# Altium project LTO 12S BMS.PrjPcb
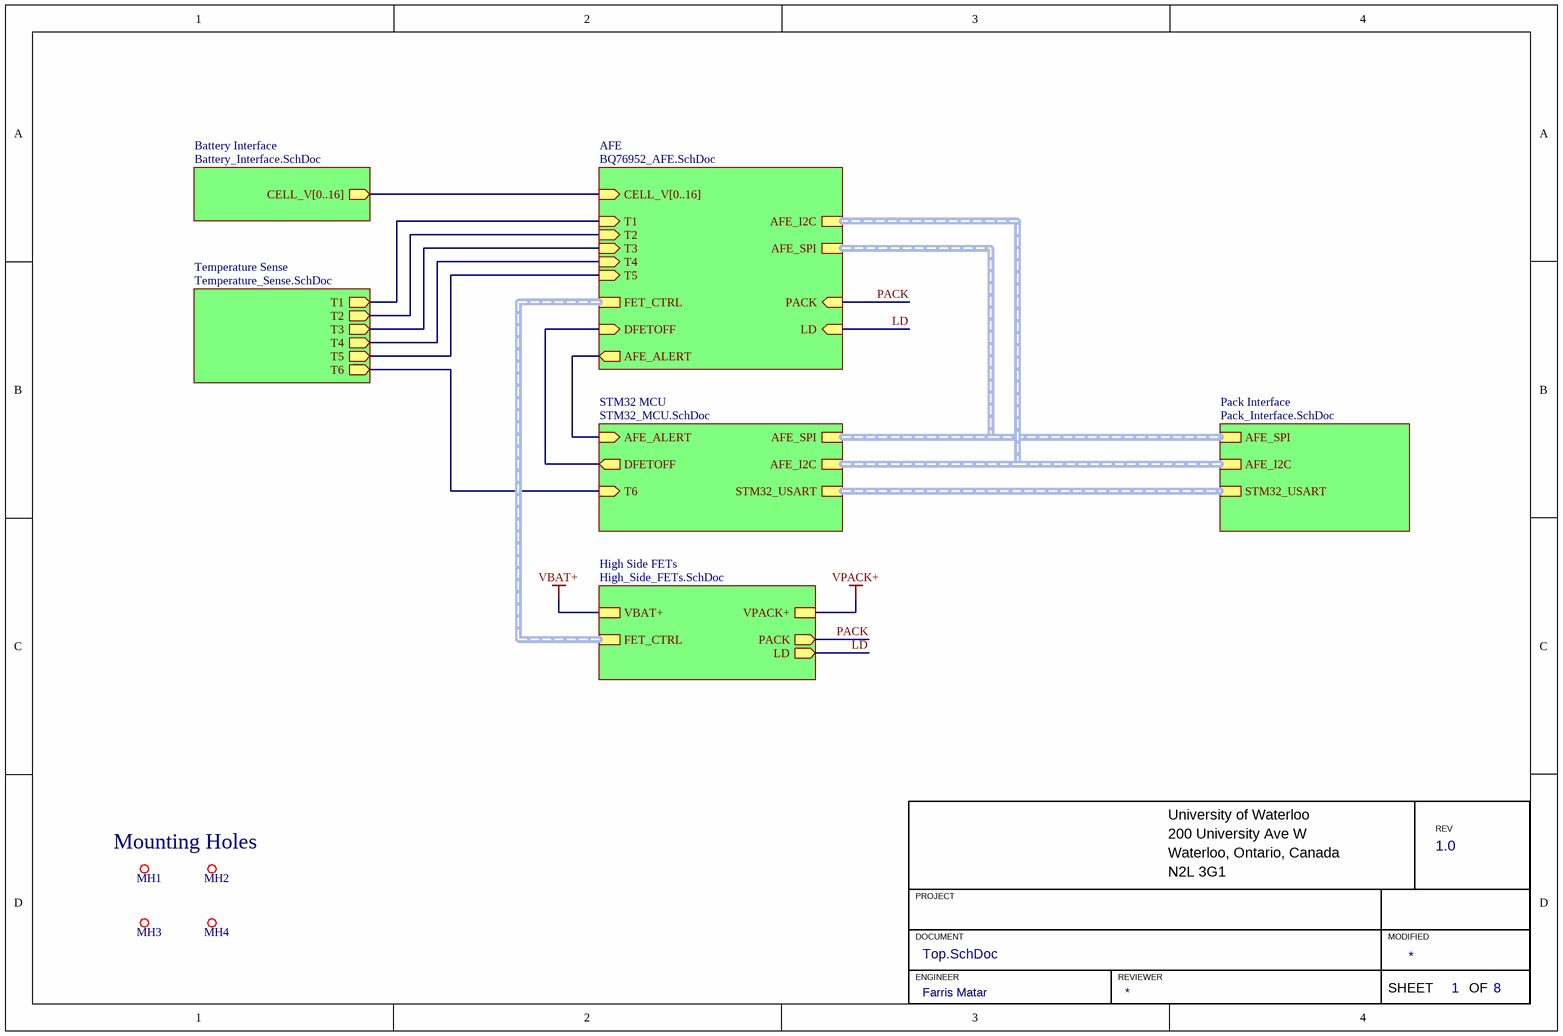
[diagram p0: Top.SchDoc]
Engineer: Farris Matar; Revision: 1.0; Title: LTO 16S BMS
7 sheets, 241 parts. Net scope: hierarchical (ports join the sheet entries above them; power ports are global).
Board file: LTO 12S BMS.PcbDoc
Sheets:
  Top.SchDoc
    Battery Interface = Battery_Interface.SchDoc
    AFE = BQ76952_AFE.SchDoc
      Balancing FETs = Balancing_FETs.SchDoc
    Temperature Sense = Temperature_Sense.SchDoc
    Pack Interface = Pack_Interface.SchDoc
    High Side FETs = High_Side_FETs.SchDoc

## Sheet Top.SchDoc: LTO 16S BMS
size A4; Engineer: Farris Matar; Organization: TESLA Motors, INC; Address1: 3500 Deer Creek Road; Address2: Palo Alto, CA; Address4: U.S.A.; SheetNumber: 1; SheetTotal: 8

### Parts
MH1  MOUNTING_HOLE_M3  [MOUNTING_HOLE_3mm]  (value not drawn)  (no BOM)
MH2  MOUNTING_HOLE_M3  [MOUNTING_HOLE_3mm]  (value not drawn)  (no BOM)
MH3  MOUNTING_HOLE_M3  [MOUNTING_HOLE_3mm]  (value not drawn)  (no BOM)
MH4  MOUNTING_HOLE_M3  [MOUNTING_HOLE_3mm]  (value not drawn)  (no BOM)

### Sub-sheets
AFE = BQ76952_AFE.SchDoc: CELL_V[0..16] (in), AFE_SPI (harness SPI), AFE_ALERT (out), T1 (in), T2 (in), T3 (in), DFETOFF (in), FET_CTRL (harness FET_CTRL), PACK (in), LD (in), AFE_I2C (harness I2C), T4 (in), T5 (in)
Battery Interface = Battery_Interface.SchDoc: CELL_V[0..16] (out)
High Side FETs = High_Side_FETs.SchDoc: LD (out), PACK (out), VPACK+, FET_CTRL (harness FET_CTRL), VBAT+
Pack Interface = Pack_Interface.SchDoc: STM32_USART (harness USART), AFE_SPI (harness SPI), AFE_I2C (harness I2C)
STM32 MCU = STM32_MCU.SchDoc (file not in this document): AFE_SPI (harness SPI), STM32_USART (harness USART), AFE_ALERT (in), DFETOFF (out), T6 (in), AFE_I2C (harness I2C)
Temperature Sense = Temperature_Sense.SchDoc: T1 (out), T2 (out), T3 (out), T6 (out), T4 (out), T5 (out)

### Nets
LD: sheet AFE/LD, sheet High Side FETs/LD
PACK: sheet AFE/PACK, sheet High Side FETs/PACK
T1: sheet AFE/T1, sheet Temperature Sense/T1
T2: sheet AFE/T2, sheet Temperature Sense/T2
T3: sheet AFE/T3, sheet Temperature Sense/T3
NetJ6#1_1: sheet AFE/T4, sheet Temperature Sense/T4
NetR59_1: sheet AFE/AFE_ALERT, sheet STM32 MCU/AFE_ALERT
NetTP43_1: sheet AFE/DFETOFF, sheet STM32 MCU/DFETOFF
NetU1_32: sheet AFE/T5, sheet Temperature Sense/T5
(unnamed): sheet Temperature Sense/T6, sheet STM32 MCU/T6

### Buses and harness runs
bus sheet AFE/CELL_V[0..16] = sheet Battery Interface/CELL_V[0..16]
harness sheet AFE/AFE_I2C = sheet Pack Interface/AFE_I2C = sheet STM32 MCU/AFE_I2C
harness sheet AFE/AFE_SPI = sheet Pack Interface/AFE_SPI = sheet STM32 MCU/AFE_SPI
harness sheet AFE/FET_CTRL = sheet High Side FETs/FET_CTRL
harness sheet Pack Interface/STM32_USART = sheet STM32 MCU/STM32_USART

### Notes on the sheet
- Mounting Holes
- University of Waterloo
- 200 University Ave W
- REV
- PROJECT
- Waterloo, Ontario, Canada
- N2L 3G1
- DOCUMENT
- ENGINEER
- REVIEWER
- MODIFIED
- SHEET
- OF

## Sheet Battery_Interface.SchDoc: LTO 16S BMS
size A4; Engineer: Farris Matar; Organization: TESLA Motors, INC; Address1: 3500 Deer Creek Road; Address2: Palo Alto, CA; Address4: U.S.A.; SheetNumber: 2; SheetTotal: 7
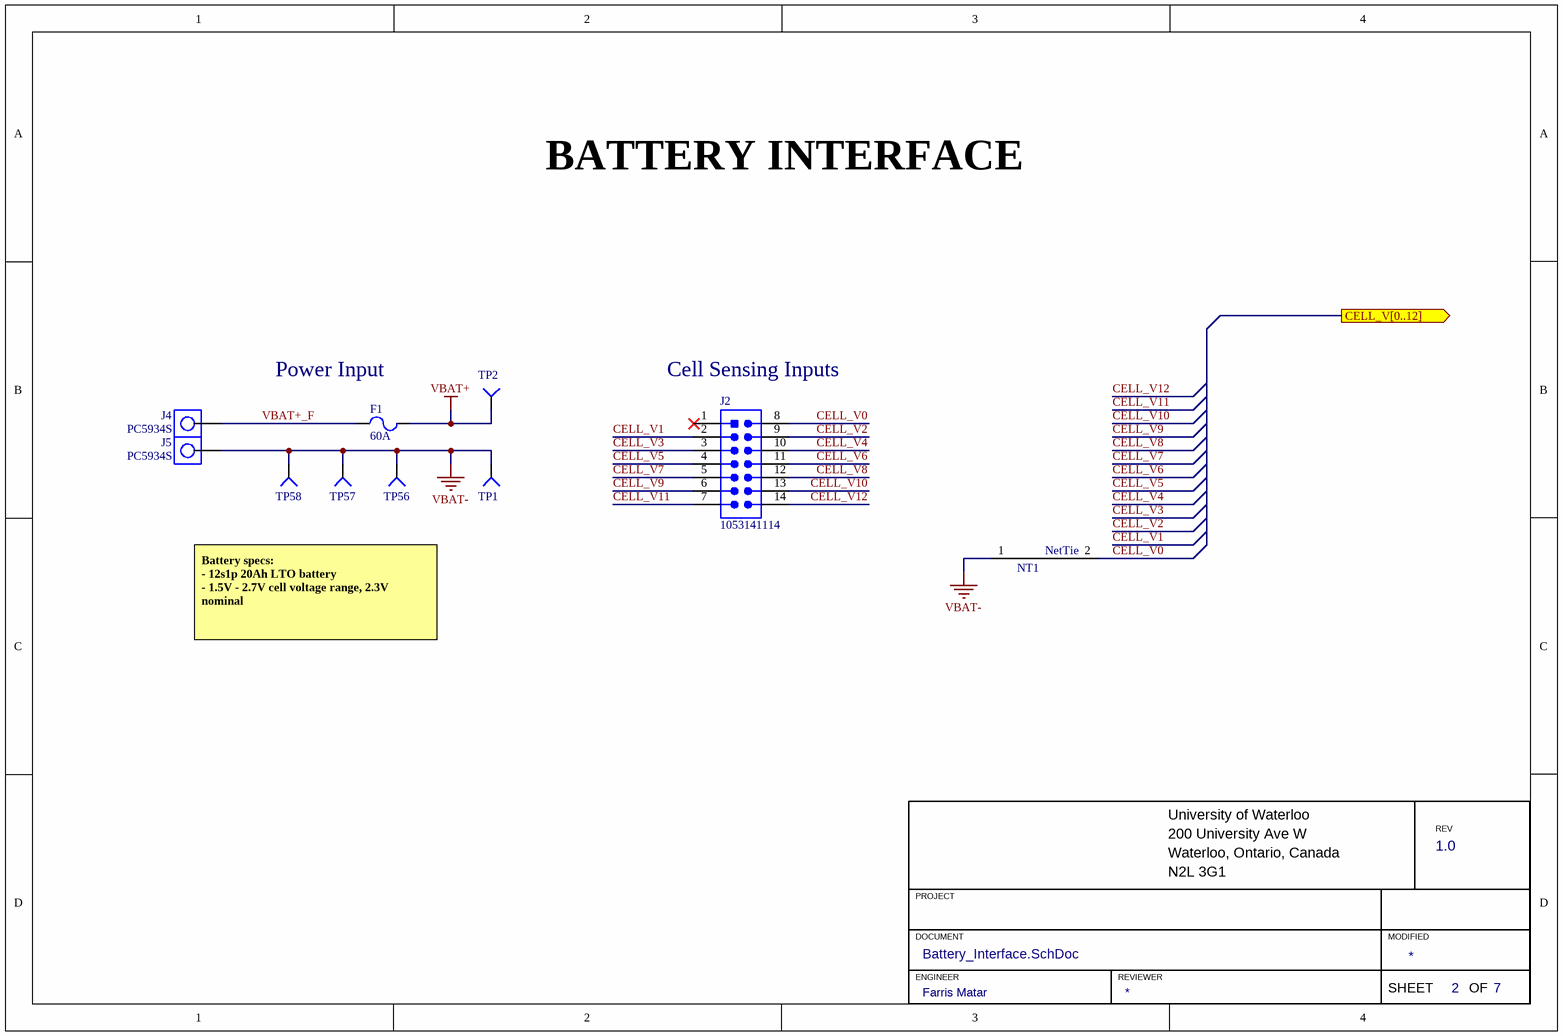
[diagram p1: Battery_Interface.SchDoc]

### Parts
(Parts that share a designator on the sheet are numbered #1, #2 ... from top to bottom, then left to right.)
F1  Current Rating: 60A  [FUSE_456SDE_LITTLEFUSE]  (hidden comment: FUSE_60A_LITTLEFUSE)
J2  1053141114  [MOLEX-NANOFIT 7x2 THRA]
J4#1  Manufacturer Part Number 1: PC5934S  [APP_PC5934S]  (hidden comment: CON_1POS_APP75)
J5#1  Manufacturer Part Number 1: PC5934S  [APP_PC5934S]  (hidden comment: CON_1POS_APP75)
NT1  NetTie  [NET_TIE]  (value not drawn)
TP1  TESTPOINT_SMD_LOOP  [S1751-46R]  (value not drawn)
TP2  TESTPOINT_SMD_LOOP  [S1751-46R]  (value not drawn)
TP56  TESTPOINT_SMD_LOOP  [S1751-46R]  (value not drawn)
TP57  TESTPOINT_SMD_LOOP  [S1751-46R]  (value not drawn)
TP58  TESTPOINT_SMD_LOOP  [S1751-46R]  (value not drawn)

### Ports
CELL_V[0..12] (out)

### Nets
VBAT+: F1.2 TP2.1(=value)
VBAT-: J5#1.1 NT1.1 TP1.1(=value) TP56.1(=value) TP57.1(=value) TP58.1(=value)
CELL_V0: J2.8 NT1.2
CELL_V1: J2.2
CELL_V2: J2.9
CELL_V3: J2.3
CELL_V4: J2.10
CELL_V5: J2.4
CELL_V6: J2.11
CELL_V7: J2.5
CELL_V8: J2.12
CELL_V9: J2.6
CELL_V10: J2.13
CELL_V11: J2.7
CELL_V12: J2.14
VBAT+_F: F1.1 J4#1.1

Not connected (* = marked no-connect by the designer): J2 1*

### Notes on the sheet
- BATTERY INTERFACE
- (near F1) Power Input
- (near J2) Cell Sensing Inputs
- Battery specs:
  - 12s1p 20Ah LTO battery
  - 1.5V - 2.7V cell voltage range, 2.3V nominal
- University of Waterloo
- 200 University Ave W
- REV
- PROJECT
- Waterloo, Ontario, Canada
- N2L 3G1
- DOCUMENT
- ENGINEER
- REVIEWER
- MODIFIED
- SHEET
- OF

### Library data of the parts
F1 = FUSE_60A_LITTLEFUSE: FUSE BRD MT 60A 250VAC 80VDC SMD; Manufacturer 1: Littelfuse Inc.; Manufacturer Part Number 1: 0456060.DRSDE; Mounting Type: SMD; Verified: No; Supplier 1: Digi-Key; Supplier Part Number 1: 18-0456060.DRSDECT-ND
J2 = CON_MOLEX-NANOFIT_7x2_THRA: CONN HEADER R/A 14POS 2.5MM; Manufacturer 1: Molex; Voltage Rating: 250V; Current Rating: 7.5A; Pitch: 2.5mm; Supplier 1: Digi-Key; Supplier Part Number 1: WM16912-ND; Manufacturer Part Number 1: 1053141114
J4#1 J5#1 = CON_1POS_APP75: TERM BLADE NON-GEND SILVER; Manufacturer 1: Anderson Power Products, Inc.; Voltage Rating: 600V; Current Rating: 55A; Supplier 1: Digi-Key; Supplier Part Number 1: 2243-PC5934S-ND
TP1 TP2 TP56-TP58 = TESTPOINT_SMD_LOOP: TESTPOINT SMD LOOP; Manufacturer 1: Harwin; Supplier 1: Digi-Key; Manufacturer Part Number 1: S1751-46R; Mounting Type: SMD; Package/Footprint: SMD; Supplier Part Number 1: 952-1478-1-ND

## Sheet BQ76952_AFE.SchDoc: LTO 16S BMS
size A4; Engineer: Farris Matar; Organization: TESLA Motors, INC; Address1: 3500 Deer Creek Road; Address2: Palo Alto, CA; Address4: U.S.A.; SheetNumber: 3; SheetTotal: 8
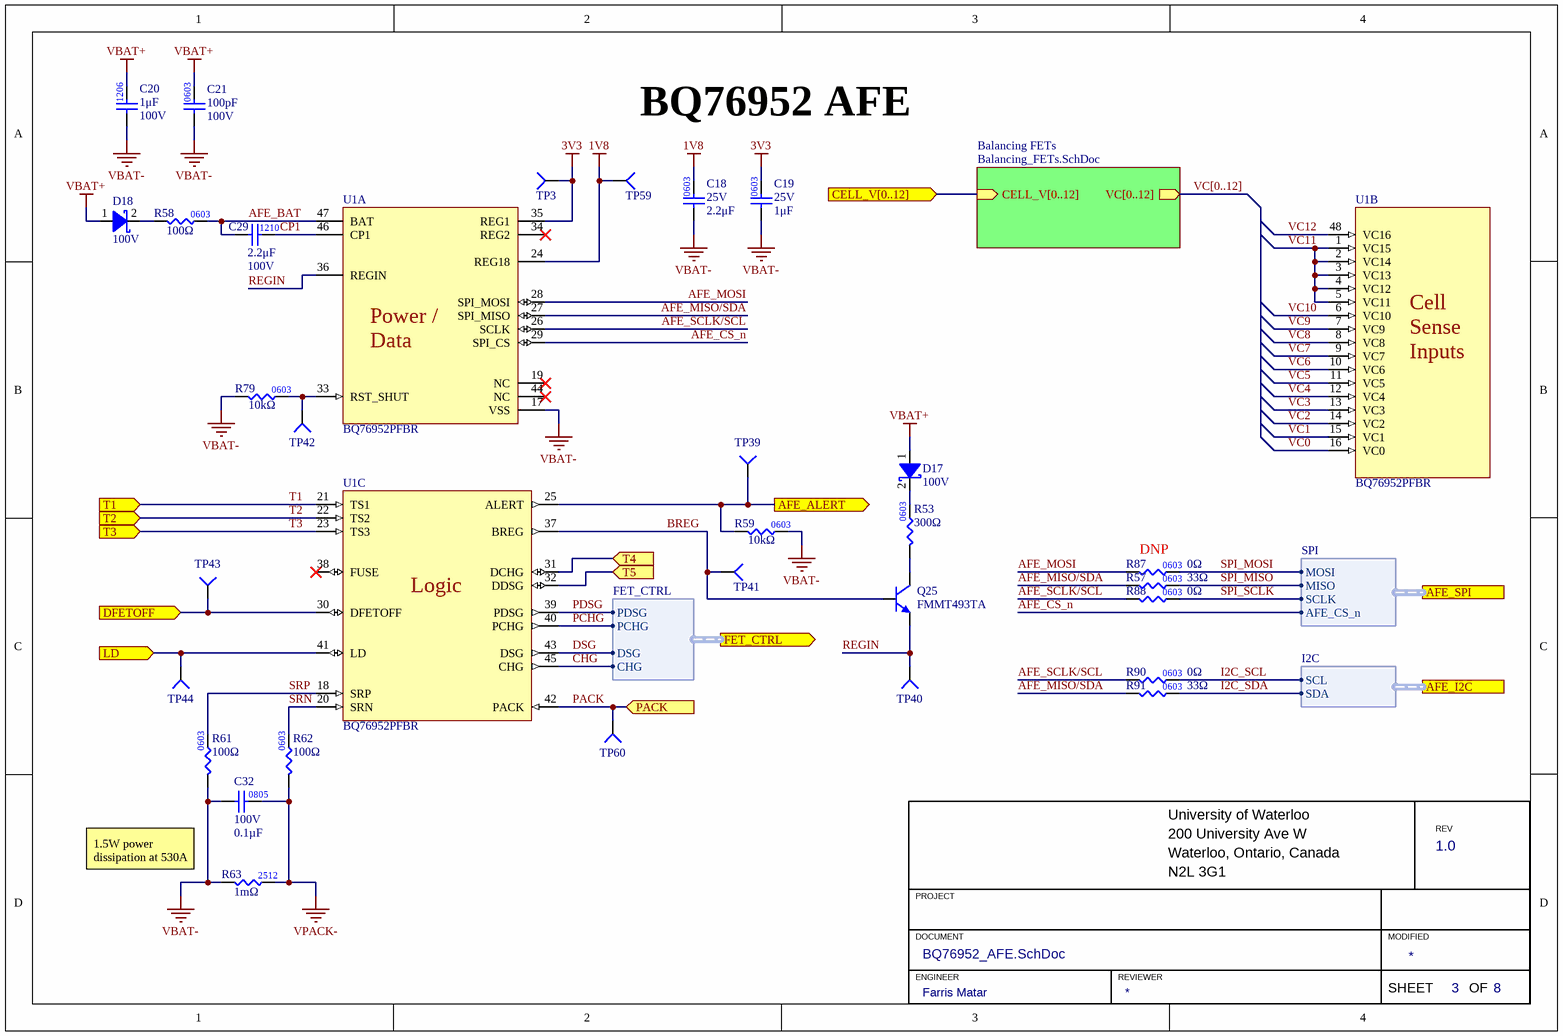
[diagram p2: BQ76952_AFE.SchDoc]

### Parts
C18  value 2.2μF  Voltage Rating: 25V  [CAP0603]  (hidden comment: CAP_2.2uF_25V_0603)
C19  value 1μF  Voltage Rating: 25V  [CAP0603]  (hidden comment: CAP_1uF_25V_0603)
C20  value 1μF  Voltage Rating: 100V  [CAP1206]  (hidden comment: CAP_1uF_100V_1206)
C21  value 100pF  Voltage Rating: 100V  [CAP2012]  (hidden comment: CAP_100pF_100V_0603)
C29  value 2.2μF  Voltage Rating: 100V  [CAP1210]  (hidden comment: CAP_2.2uF_100V_1210)
C32  value 0.1µF  Voltage Rating: 100V  [CAP0805]  (hidden comment: CAP_0.1uF_100V_0805)
D17  Vr (Max): 100V  [SOD-123_FLAT]  (hidden comment: DIO_SCHOTTKY_100V_1A)
D18  Vr (Max): 100V  [SOD-123_FLAT]  (hidden comment: DIO_SCHOTTKY_100V_1A)
Q25  Manufacturer Part Number 1: FMMT493TA  [SOT23-3]  (hidden comment: NPN_100V_1A)
R53  value 300Ω  [RES0603]  (hidden comment: RES_300Ω_0603_1%)
R57  value 33Ω  [RES0603]  (hidden comment: RES_33Ω_0603_1%)
R58  value 100Ω  [RES0603]  (hidden comment: RES_100Ω_0603_1%)
R59  value 10kΩ  [RES0603]  (hidden comment: RES_10kΩ_0603_1%)
R61  value 100Ω  [RES0603]  (hidden comment: RES_100Ω_0603_1%)
R62  value 100Ω  [RES0603]  (hidden comment: RES_100Ω_0603_1%)
R63  value 1mΩ  [RESC6532X75N]  (hidden comment: RES_1mΩ_2512_1%)
R79  value 10kΩ  [RES0603]  (hidden comment: RES_10kΩ_0603_1%)
R87  value 0Ω  [RES0603]  (hidden comment: RES_0Ω_0603)
R88  value 0Ω  [RES0603]  (hidden comment: RES_0Ω_0603)
R90  value 0Ω  [RES0603]  (hidden comment: RES_0Ω_0603)
R91  value 33Ω  [RES0603]  (hidden comment: RES_33Ω_0603_1%)
TP3  TESTPOINT_SMD_LOOP  [S1751-46R]  (value not drawn)
TP39  TESTPOINT_1MM_CIRCLE  [TESTPOINT_CIRCLE_1MM]  (value not drawn)  (no BOM)
TP40  TESTPOINT_1MM_CIRCLE  [TESTPOINT_CIRCLE_1MM]  (value not drawn)  (no BOM)
TP41  TESTPOINT_1MM_CIRCLE  [TESTPOINT_CIRCLE_1MM]  (value not drawn)  (no BOM)
TP42  TESTPOINT_1MM_CIRCLE  [TESTPOINT_CIRCLE_1MM]  (value not drawn)  (no BOM)
TP43  TESTPOINT_1MM_CIRCLE  [TESTPOINT_CIRCLE_1MM]  (value not drawn)  (no BOM)
TP44  TESTPOINT_1MM_CIRCLE  [TESTPOINT_CIRCLE_1MM]  (value not drawn)  (no BOM)
TP59  TESTPOINT_1MM_SQUARE  [TESTPOINT_SQUARE_1MM]  (value not drawn)  (no BOM)
TP60  TESTPOINT_1MM_CIRCLE  [TESTPOINT_CIRCLE_1MM]  (value not drawn)  (no BOM)
U1  BQ76952PFBR  [TI_48-TQFP]  (parts A,B,C of 3)

### Sub-sheets
Balancing FETs = Balancing_FETs.SchDoc: CELL_V[0..12] (in), VC[0..12] (out)

### Ports
AFE_ALERT (out), AFE_I2C (harness I2C), AFE_SPI (harness SPI), CELL_V[0..12] (in), DFETOFF (in), FET_CTRL (out, harness FET_CTRL), LD (in), PACK (in), T1 (in), T2 (in), T3 (in), T4 (in), T5 (in)

### Harnesses
SPI: MOSI, MISO, SCLK, AFE_CS_n
FET_CTRL: PDSG, PCHG, DSG, CHG
I2C: SCL, SDA

### Nets
1V8: C18.2 TP59.1(=value) U1.24(REG18)
3V3: C19.2 TP3.1(=value) U1.35(REG1)
VBAT+: C20.2 C21.2 D17.1(Anode) D18.1(Anode)
VBAT-: C18.1 C19.1 C20.1 C21.1 C32.1 R59.2 R61.1 R63.1 R79.1 U1.17(VSS)
VPACK-: C32.2 R62.1 R63.2
AFE_BAT: C29.1 R58.2 U1.47(BAT)
AFE_CS_n: U1.29(SPI_CS) ; port AFE_SPI.AFE_CS_n
AFE_MISO/SDA: R57.1 R91.1 U1.27(SPI_MISO)
AFE_MOSI: R87.1 U1.28(SPI_MOSI)
AFE_SCLK/SCL: R88.1 R90.1 U1.26(SCLK)
BREG: Q25.1(B) TP41.1(=value) U1.37(BREG)
CHG: U1.45(CHG) ; port FET_CTRL.CHG
CP1: C29.2 U1.46(CP1)
DSG: U1.43(DSG) ; port FET_CTRL.DSG
I2C_SCL: R90.2 ; port AFE_I2C.SCL
I2C_SDA: R91.2 ; port AFE_I2C.SDA
LD: TP44.1(=value) U1.41(LD) ; port LD
PACK: TP60.1(=value) U1.42(PACK) ; port PACK
PCHG: U1.40(PCHG) ; port FET_CTRL.PCHG
PDSG: U1.39(PDSG) ; port FET_CTRL.PDSG
REGIN: Q25.2(E) TP40.1(=value) U1.36(REGIN)
SPI_MISO: R57.2 ; port AFE_SPI.MISO
SPI_MOSI: R87.2 ; port AFE_SPI.MOSI
SPI_SCLK: R88.2 ; port AFE_SPI.SCLK
SRN: R62.2 U1.20(SRN)
SRP: R61.2 U1.18(SRP)
T1: U1.21(TS1) ; port T1
T2: U1.22(TS2) ; port T2
T3: U1.23(TS3) ; port T3
VC0: U1.16(VC0)
VC1: U1.15(VC1)
VC2: U1.14(VC2)
VC3: U1.13(VC3)
VC4: U1.12(VC4)
VC5: U1.11(VC5)
VC6: U1.10(VC6)
VC7: U1.9(VC7)
VC8: U1.8(VC8)
VC9: U1.7(VC9)
VC10: U1.6(VC10)
VC11: U1.1(VC15) U1.2(VC14) U1.3(VC13) U1.4(VC12) U1.5(VC11)
VC12: U1.48(VC16)
NetD17_2: D17.2(Cathode) R53.2
NetD18_2: D18.2(Cathode) R58.1
NetJ6#1_1: U1.31(DCHG) ; port T4
NetQ25_3: Q25.3(C) R53.1
NetR59_1: R59.1 TP39.1(=value) U1.25(ALERT) ; port AFE_ALERT
NetR79_2: R79.2 TP42.1(=value) U1.33(RST_SHUT)
NetTP43_1: TP43.1(=value) U1.30(DFETOFF) ; port DFETOFF
NetU1_32: U1.32(DDSG) ; port T5

Not connected (* = marked no-connect by the designer): U1 19(NC)* 34(REG2)* 38(FUSE)* 44(NC)*

### Buses and harness runs
bus port CELL_V[0..12] = sheet Balancing FETs/CELL_V[0..12]
bus VC[0..12] = sheet Balancing FETs/VC[0..12]

### Notes on the sheet
- BQ76952 AFE
- (near R87) DNP
- University of Waterloo
- 200 University Ave W
- REV
- 1.5W power dissipation at 530A
- PROJECT
- Waterloo, Ontario, Canada
- N2L 3G1
- DOCUMENT
- ENGINEER
- REVIEWER
- MODIFIED
- SHEET
- OF
- (in symbol BQ7695204PFBR, part A) Power / / Data
- (in symbol BQ7695204PFBR, part B) Cell / Sense / Inputs
- (in symbol BQ7695204PFBR, part C) Logic
- (in symbol CAP_2.2uF_25V_0603) 0603
- (in symbol CAP_2.2uF_100V_1210) 1210
- (in symbol RES_100Ω_0603_1%) 0603

### Library data of the parts
C18 = CAP_2.2uF_25V_0603: CAP CER 2.2UF 25V X5R 0603; Manufacturer Part Number 1: C1608X5R1E225K080AB; Manufacturer 1: TDK Corporation; Dielectric: 5; Supplier Part Number 1: 445-5964-1-ND; Supplier 1: Digi-Key
C19 = CAP_1uF_25V_0603: CAP CER 1UF 25V X5R 0603; Manufacturer 1: Samsung; Manufacturer Part Number 1: CL10A105KA8NNNC; Supplier 1: Digi-Key; Mounting Type: SMD; Package: 0603; Supplier Part Number 1: 1276-1102-1-ND; Dielectric: X5R
C20 = CAP_1uF_100V_1206: CAP CER 1UF 100V X7R 1206; Supplier 1: Digi-Key; Mounting Type: SMD; Package: 1206; Supplier Part Number 1: 490-16468-1-ND
C21 = CAP_100pF_100V_0603: CAP CER 100PF 100V X7R 0603; Manufacturer 1: YAGEO; Manufacturer Part Number 1: CC0603KRX7R0BB101; Package/Footprint: 0603; Mounting Type: SMD; Dielectric: X7R; Supplier 1: Digi-Key; Supplier Part Number 1: 311-4048-1-ND
C29 = CAP_2.2uF_100V_1210: CAP CER 2.2UF 100V X7R 1210; Manufacturer 1: Taiyo Yuden; Manufacturer Part Number 1: HMK325B7225KMHP; Dielectric: X7R; Supplier 1: Digi-Key; Supplier Part Number 1: 587-5396-1-ND
C32 = CAP_0.1uF_100V_0805: CAP CER 0.1UF 100V X7R 0805; Manufacturer 1: TDK Corporation; Manufacturer Part Number 1: C2012X7R2A104K125AA; Package: 0805; Supplier 1: Digi-Key; Supplier Part Number 1: 445-1418-1-ND
D17 D18 = DIO_SCHOTTKY_100V_1A: DIODE SCHOTTKY 100V 1A SOD-123F; Manufacturer 1: SMC Diode Solutions; Manufacturer Part Number 1: DSS110U; Supplier 1: Digi-Key; Supplier Part Number 1: 1655-DSS110UCT-ND; Mounting Type: SMD; Package/Footprint: SOD-123F
Q25 = NPN_100V_1A: TRANS NPN 100V 1A SOT23-3; Manufacturer 1: Diodes Incorporated; Package: SOT-23-3; Supplier Part Number 1: FMMT493CT-ND; Supplier 1: Digi-Key
R53 = RES_300Ω_0603_1%: RES 200 OHM 1% 1/10W 0603; Manufacturer 1: YAGEO; Manufacturer Part Number 1: RL0603FR-070R3L; Supplier 1: Digi-Key; Supplier Part Number 1: 13-RL0603FR-070R3LCT-ND; Package: 0603; Tolerance: 1%
R57 R91 = RES_33Ω_0603_1%: RES 33 OHM 1% 1/10W 0603; Manufacturer 1: Vishay; Manufacturer Part Number 1: CRCW060333R0FKEA; Supplier 1: Digi-Key; Mounting Type: SMD; Supplier Part Number 1: 541-33.0HCT-ND; Package: 0603
R58 R61 R62 = RES_100Ω_0603_1%: RES 100 OHM 1% 1/10W 0603; Manufacturer 1: Yageo; Manufacturer Part Number 1: RC0603FR-07100RL; Supplier Part Number 1: 311-100HRCT-ND; Supplier 1: Digi-Key
R59 R79 = RES_10kΩ_0603_1%: RES 10K OHM 1% 1/8W 0603; Manufacturer 1: Stackpole Electronics Inc; Manufacturer Part Number 1: RNCP0603FTD10K0; Supplier Part Number 1: RNCP0603FTD10K0CT-ND; Supplier 1: Digi-Key; Mounting Type: SMD; Package: 0603
R63 = RES_1mΩ_2512_1%: RES 1 mOHM 1% 3W 2512; Manufacturer 1: Riedon; Manufacturer Part Number 1: CSRL3-0R001F8; Supplier 1: Digi-Key; Supplier Part Number 1: 696-1834-1-ND; Mounting Type: SMD; Package: 2512
R87 R88 R90 = RES_0Ω_0603: RES 0 OHM JUMPER 1/10W 0603; Manufacturer 1: Yageo; Manufacturer Part Number 1: RC0603JR-070RL; Supplier Part Number 1: 311-0.0GRCT-ND; Supplier 1: Digi-Key; Mounting Type: SMD; Package: 0603
TP3 = TESTPOINT_SMD_LOOP: as TP1 on sheet Battery_Interface; Supplier 1: Digi-Key; Manufacturer Part Number 1: S1751-46R; Mounting Type: SMD; Package/Footprint: SMD; Supplier Part Number 1: 952-1478-1-ND
TP39-TP44 TP60 = TESTPOINT_1MM_CIRCLE: TESTPOINT 1MM CIRCLE
TP59 = TESTPOINT_1MM_SQUARE: TESTPOINT 1MM SQUARE
U1 = BQ7695204PFBR: IC BAT LIFEPO4/LI-ION 3-16C TQFP; Manufacturer 1: Texas Instruments; Package/Footprint: 48-TQFP; Manufacturer Part Number 1: BQ76952PFBR; Supplier 1: Digi-Key; Supplier Part Number 1: 296-BQ76952PFBRCT-ND

## Sheet Balancing_FETs.SchDoc: LTO 16S BMS
size A4; Engineer: Farris Matar; Organization: TESLA Motors, INC; Address1: 3500 Deer Creek Road; Address2: Palo Alto, CA; Address4: U.S.A.; SheetNumber: 4; SheetTotal: 8
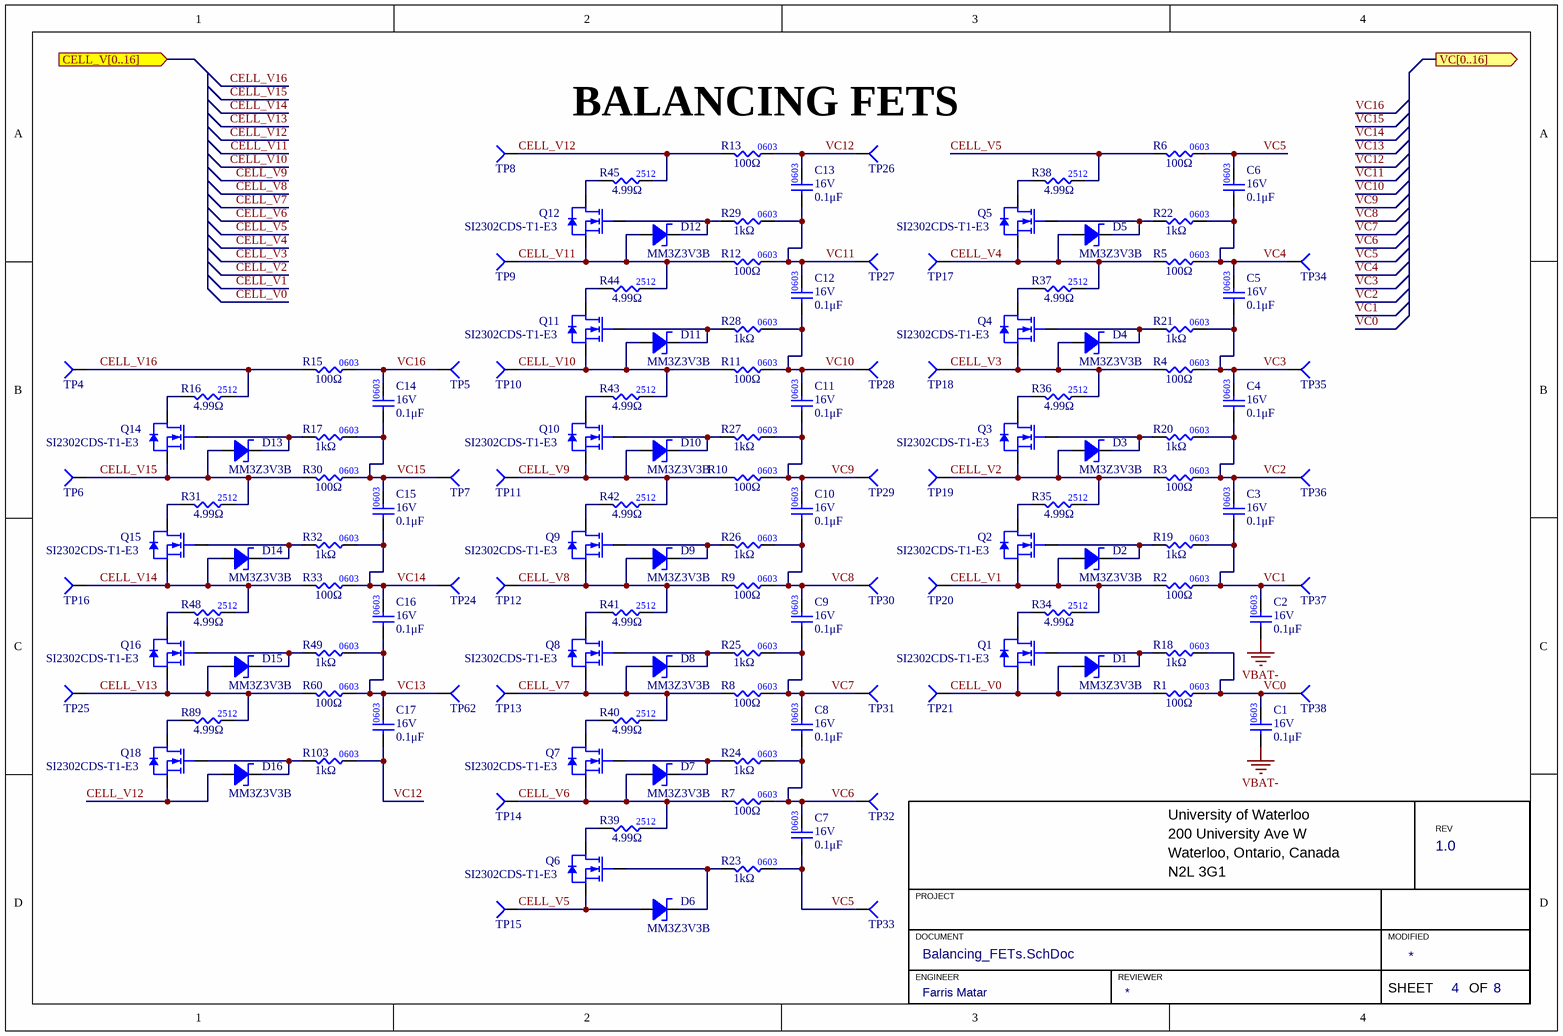
[diagram p3: Balancing_FETs.SchDoc]

### Parts
C1  value 0.1μF  Voltage Rating: 16V  [CAP0603]  (hidden comment: CAP_0.1uF_16V_0603)
C2  value 0.1μF  Voltage Rating: 16V  [CAP0603]  (hidden comment: CAP_0.1uF_16V_0603)
C3  value 0.1μF  Voltage Rating: 16V  [CAP0603]  (hidden comment: CAP_0.1uF_16V_0603)
C4  value 0.1μF  Voltage Rating: 16V  [CAP0603]  (hidden comment: CAP_0.1uF_16V_0603)
C5  value 0.1μF  Voltage Rating: 16V  [CAP0603]  (hidden comment: CAP_0.1uF_16V_0603)
C6  value 0.1μF  Voltage Rating: 16V  [CAP0603]  (hidden comment: CAP_0.1uF_16V_0603)
C7  value 0.1μF  Voltage Rating: 16V  [CAP0603]  (hidden comment: CAP_0.1uF_16V_0603)
C8  value 0.1μF  Voltage Rating: 16V  [CAP0603]  (hidden comment: CAP_0.1uF_16V_0603)
C9  value 0.1μF  Voltage Rating: 16V  [CAP0603]  (hidden comment: CAP_0.1uF_16V_0603)
C10  value 0.1μF  Voltage Rating: 16V  [CAP0603]  (hidden comment: CAP_0.1uF_16V_0603)
C11  value 0.1μF  Voltage Rating: 16V  [CAP0603]  (hidden comment: CAP_0.1uF_16V_0603)
C12  value 0.1μF  Voltage Rating: 16V  [CAP0603]  (hidden comment: CAP_0.1uF_16V_0603)
C13  value 0.1μF  Voltage Rating: 16V  [CAP0603]  (hidden comment: CAP_0.1uF_16V_0603)
C14  value 0.1μF  Voltage Rating: 16V  [CAP0603]  (hidden comment: CAP_0.1uF_16V_0603)
C15  value 0.1μF  Voltage Rating: 16V  [CAP0603]  (hidden comment: CAP_0.1uF_16V_0603)
C16  value 0.1μF  Voltage Rating: 16V  [CAP0603]  (hidden comment: CAP_0.1uF_16V_0603)
C17  value 0.1μF  Voltage Rating: 16V  [CAP0603]  (hidden comment: CAP_0.1uF_16V_0603)
D1  Manufacturer Part Number 1: MM3Z3V3B  [DIO_ZENER_3V3]  (hidden comment: DIO_ZENER_3V3)
D2  Manufacturer Part Number 1: MM3Z3V3B  [DIO_ZENER_3V3]  (hidden comment: DIO_ZENER_3V3)
D3  Manufacturer Part Number 1: MM3Z3V3B  [DIO_ZENER_3V3]  (hidden comment: DIO_ZENER_3V3)
D4  Manufacturer Part Number 1: MM3Z3V3B  [DIO_ZENER_3V3]  (hidden comment: DIO_ZENER_3V3)
D5  Manufacturer Part Number 1: MM3Z3V3B  [DIO_ZENER_3V3]  (hidden comment: DIO_ZENER_3V3)
D6  Manufacturer Part Number 1: MM3Z3V3B  [DIO_ZENER_3V3]  (hidden comment: DIO_ZENER_3V3)
D7  Manufacturer Part Number 1: MM3Z3V3B  [DIO_ZENER_3V3]  (hidden comment: DIO_ZENER_3V3)
D8  Manufacturer Part Number 1: MM3Z3V3B  [DIO_ZENER_3V3]  (hidden comment: DIO_ZENER_3V3)
D9  Manufacturer Part Number 1: MM3Z3V3B  [DIO_ZENER_3V3]  (hidden comment: DIO_ZENER_3V3)
D10  Manufacturer Part Number 1: MM3Z3V3B  [DIO_ZENER_3V3]  (hidden comment: DIO_ZENER_3V3)
D11  Manufacturer Part Number 1: MM3Z3V3B  [DIO_ZENER_3V3]  (hidden comment: DIO_ZENER_3V3)
D12  Manufacturer Part Number 1: MM3Z3V3B  [DIO_ZENER_3V3]  (hidden comment: DIO_ZENER_3V3)
D13  Manufacturer Part Number 1: MM3Z3V3B  [DIO_ZENER_3V3]  (hidden comment: DIO_ZENER_3V3)
D14  Manufacturer Part Number 1: MM3Z3V3B  [DIO_ZENER_3V3]  (hidden comment: DIO_ZENER_3V3)
D15  Manufacturer Part Number 1: MM3Z3V3B  [DIO_ZENER_3V3]  (hidden comment: DIO_ZENER_3V3)
D16  Manufacturer Part Number 1: MM3Z3V3B  [DIO_ZENER_3V3]  (hidden comment: DIO_ZENER_3V3)
Q1  Manufacturer Part Number 1: SI2302CDS-T1-E3  [SOT23-3]  (hidden comment: NMOS_20V_6A)
Q2  Manufacturer Part Number 1: SI2302CDS-T1-E3  [SOT23-3]  (hidden comment: NMOS_20V_6A)
Q3  Manufacturer Part Number 1: SI2302CDS-T1-E3  [SOT23-3]  (hidden comment: NMOS_20V_6A)
Q4  Manufacturer Part Number 1: SI2302CDS-T1-E3  [SOT23-3]  (hidden comment: NMOS_20V_6A)
Q5  Manufacturer Part Number 1: SI2302CDS-T1-E3  [SOT23-3]  (hidden comment: NMOS_20V_6A)
Q6  Manufacturer Part Number 1: SI2302CDS-T1-E3  [SOT23-3]  (hidden comment: NMOS_20V_6A)
Q7  Manufacturer Part Number 1: SI2302CDS-T1-E3  [SOT23-3]  (hidden comment: NMOS_20V_6A)
Q8  Manufacturer Part Number 1: SI2302CDS-T1-E3  [SOT23-3]  (hidden comment: NMOS_20V_6A)
Q9  Manufacturer Part Number 1: SI2302CDS-T1-E3  [SOT23-3]  (hidden comment: NMOS_20V_6A)
Q10  Manufacturer Part Number 1: SI2302CDS-T1-E3  [SOT23-3]  (hidden comment: NMOS_20V_6A)
Q11  Manufacturer Part Number 1: SI2302CDS-T1-E3  [SOT23-3]  (hidden comment: NMOS_20V_6A)
Q12  Manufacturer Part Number 1: SI2302CDS-T1-E3  [SOT23-3]  (hidden comment: NMOS_20V_6A)
Q14  Manufacturer Part Number 1: SI2302CDS-T1-E3  [SOT23-3]  (hidden comment: NMOS_20V_6A)
Q15  Manufacturer Part Number 1: SI2302CDS-T1-E3  [SOT23-3]  (hidden comment: NMOS_20V_6A)
Q16  Manufacturer Part Number 1: SI2302CDS-T1-E3  [SOT23-3]  (hidden comment: NMOS_20V_6A)
Q18  Manufacturer Part Number 1: SI2302CDS-T1-E3  [SOT23-3]  (hidden comment: NMOS_20V_6A)
R1  value 100Ω  [RES0603]  (hidden comment: RES_100Ω_0603_1%)
R2  value 100Ω  [RES0603]  (hidden comment: RES_100Ω_0603_1%)
R3  value 100Ω  [RES0603]  (hidden comment: RES_100Ω_0603_1%)
R4  value 100Ω  [RES0603]  (hidden comment: RES_100Ω_0603_1%)
R5  value 100Ω  [RES0603]  (hidden comment: RES_100Ω_0603_1%)
R6  value 100Ω  [RES0603]  (hidden comment: RES_100Ω_0603_1%)
R7  value 100Ω  [RES0603]  (hidden comment: RES_100Ω_0603_1%)
R8  value 100Ω  [RES0603]  (hidden comment: RES_100Ω_0603_1%)
R9  value 100Ω  [RES0603]  (hidden comment: RES_100Ω_0603_1%)
R10  value 100Ω  [RES0603]  (hidden comment: RES_100Ω_0603_1%)
R11  value 100Ω  [RES0603]  (hidden comment: RES_100Ω_0603_1%)
R12  value 100Ω  [RES0603]  (hidden comment: RES_100Ω_0603_1%)
R13  value 100Ω  [RES0603]  (hidden comment: RES_100Ω_0603_1%)
R15  value 100Ω  [RES0603]  (hidden comment: RES_100Ω_0603_1%)
R16  value 4.99Ω  [RES2512]  (hidden comment: RES_4.99Ω_2512_1%)
R17  value 1kΩ  [RES0603]  (hidden comment: RES_1kΩ_0603_1%)
R18  value 1kΩ  [RES0603]  (hidden comment: RES_1kΩ_0603_1%)
R19  value 1kΩ  [RES0603]  (hidden comment: RES_1kΩ_0603_1%)
R20  value 1kΩ  [RES0603]  (hidden comment: RES_1kΩ_0603_1%)
R21  value 1kΩ  [RES0603]  (hidden comment: RES_1kΩ_0603_1%)
R22  value 1kΩ  [RES0603]  (hidden comment: RES_1kΩ_0603_1%)
R23  value 1kΩ  [RES0603]  (hidden comment: RES_1kΩ_0603_1%)
R24  value 1kΩ  [RES0603]  (hidden comment: RES_1kΩ_0603_1%)
R25  value 1kΩ  [RES0603]  (hidden comment: RES_1kΩ_0603_1%)
R26  value 1kΩ  [RES0603]  (hidden comment: RES_1kΩ_0603_1%)
R27  value 1kΩ  [RES0603]  (hidden comment: RES_1kΩ_0603_1%)
R28  value 1kΩ  [RES0603]  (hidden comment: RES_1kΩ_0603_1%)
R29  value 1kΩ  [RES0603]  (hidden comment: RES_1kΩ_0603_1%)
R30  value 100Ω  [RES0603]  (hidden comment: RES_100Ω_0603_1%)
R31  value 4.99Ω  [RES2512]  (hidden comment: RES_4.99Ω_2512_1%)
R32  value 1kΩ  [RES0603]  (hidden comment: RES_1kΩ_0603_1%)
R33  value 100Ω  [RES0603]  (hidden comment: RES_100Ω_0603_1%)
R34  value 4.99Ω  [RES2512]  (hidden comment: RES_4.99Ω_2512_1%)
R35  value 4.99Ω  [RES2512]  (hidden comment: RES_4.99Ω_2512_1%)
R36  value 4.99Ω  [RES2512]  (hidden comment: RES_4.99Ω_2512_1%)
R37  value 4.99Ω  [RES2512]  (hidden comment: RES_4.99Ω_2512_1%)
R38  value 4.99Ω  [RES2512]  (hidden comment: RES_4.99Ω_2512_1%)
R39  value 4.99Ω  [RES2512]  (hidden comment: RES_4.99Ω_2512_1%)
R40  value 4.99Ω  [RES2512]  (hidden comment: RES_4.99Ω_2512_1%)
R41  value 4.99Ω  [RES2512]  (hidden comment: RES_4.99Ω_2512_1%)
R42  value 4.99Ω  [RES2512]  (hidden comment: RES_4.99Ω_2512_1%)
R43  value 4.99Ω  [RES2512]  (hidden comment: RES_4.99Ω_2512_1%)
R44  value 4.99Ω  [RES2512]  (hidden comment: RES_4.99Ω_2512_1%)
R45  value 4.99Ω  [RES2512]  (hidden comment: RES_4.99Ω_2512_1%)
R48  value 4.99Ω  [RES2512]  (hidden comment: RES_4.99Ω_2512_1%)
R49  value 1kΩ  [RES0603]  (hidden comment: RES_1kΩ_0603_1%)
R60  value 100Ω  [RES0603]  (hidden comment: RES_100Ω_0603_1%)
R89  value 4.99Ω  [RES2512]  (hidden comment: RES_4.99Ω_2512_1%)
R103  value 1kΩ  [RES0603]  (hidden comment: RES_1kΩ_0603_1%)
TP4  TESTPOINT_1MM_SQUARE  [TESTPOINT_SQUARE_1MM]  (value not drawn)  (no BOM)
TP5  TESTPOINT_1MM_SQUARE  [TESTPOINT_SQUARE_1MM]  (value not drawn)  (no BOM)
TP6  TESTPOINT_1MM_SQUARE  [TESTPOINT_SQUARE_1MM]  (value not drawn)  (no BOM)
TP7  TESTPOINT_1MM_SQUARE  [TESTPOINT_SQUARE_1MM]  (value not drawn)  (no BOM)
TP8  TESTPOINT_1MM_SQUARE  [TESTPOINT_SQUARE_1MM]  (value not drawn)  (no BOM)
TP9  TESTPOINT_1MM_SQUARE  [TESTPOINT_SQUARE_1MM]  (value not drawn)  (no BOM)
TP10  TESTPOINT_1MM_SQUARE  [TESTPOINT_SQUARE_1MM]  (value not drawn)  (no BOM)
TP11  TESTPOINT_1MM_SQUARE  [TESTPOINT_SQUARE_1MM]  (value not drawn)  (no BOM)
TP12  TESTPOINT_1MM_SQUARE  [TESTPOINT_SQUARE_1MM]  (value not drawn)  (no BOM)
TP13  TESTPOINT_1MM_SQUARE  [TESTPOINT_SQUARE_1MM]  (value not drawn)  (no BOM)
TP14  TESTPOINT_1MM_SQUARE  [TESTPOINT_SQUARE_1MM]  (value not drawn)  (no BOM)
TP15  TESTPOINT_1MM_SQUARE  [TESTPOINT_SQUARE_1MM]  (value not drawn)  (no BOM)
TP16  TESTPOINT_1MM_SQUARE  [TESTPOINT_SQUARE_1MM]  (value not drawn)  (no BOM)
TP17  TESTPOINT_1MM_SQUARE  [TESTPOINT_SQUARE_1MM]  (value not drawn)  (no BOM)
TP18  TESTPOINT_1MM_SQUARE  [TESTPOINT_SQUARE_1MM]  (value not drawn)  (no BOM)
TP19  TESTPOINT_1MM_SQUARE  [TESTPOINT_SQUARE_1MM]  (value not drawn)  (no BOM)
TP20  TESTPOINT_1MM_SQUARE  [TESTPOINT_SQUARE_1MM]  (value not drawn)  (no BOM)
TP21  TESTPOINT_1MM_SQUARE  [TESTPOINT_SQUARE_1MM]  (value not drawn)  (no BOM)
TP24  TESTPOINT_1MM_SQUARE  [TESTPOINT_SQUARE_1MM]  (value not drawn)  (no BOM)
TP25  TESTPOINT_1MM_SQUARE  [TESTPOINT_SQUARE_1MM]  (value not drawn)  (no BOM)
TP26  TESTPOINT_1MM_SQUARE  [TESTPOINT_SQUARE_1MM]  (value not drawn)  (no BOM)
TP27  TESTPOINT_1MM_SQUARE  [TESTPOINT_SQUARE_1MM]  (value not drawn)  (no BOM)
TP28  TESTPOINT_1MM_SQUARE  [TESTPOINT_SQUARE_1MM]  (value not drawn)  (no BOM)
TP29  TESTPOINT_1MM_SQUARE  [TESTPOINT_SQUARE_1MM]  (value not drawn)  (no BOM)
TP30  TESTPOINT_1MM_SQUARE  [TESTPOINT_SQUARE_1MM]  (value not drawn)  (no BOM)
TP31  TESTPOINT_1MM_SQUARE  [TESTPOINT_SQUARE_1MM]  (value not drawn)  (no BOM)
TP32  TESTPOINT_1MM_SQUARE  [TESTPOINT_SQUARE_1MM]  (value not drawn)  (no BOM)
TP33  TESTPOINT_1MM_SQUARE  [TESTPOINT_SQUARE_1MM]  (value not drawn)  (no BOM)
TP34  TESTPOINT_1MM_SQUARE  [TESTPOINT_SQUARE_1MM]  (value not drawn)  (no BOM)
TP35  TESTPOINT_1MM_SQUARE  [TESTPOINT_SQUARE_1MM]  (value not drawn)  (no BOM)
TP36  TESTPOINT_1MM_SQUARE  [TESTPOINT_SQUARE_1MM]  (value not drawn)  (no BOM)
TP37  TESTPOINT_1MM_SQUARE  [TESTPOINT_SQUARE_1MM]  (value not drawn)  (no BOM)
TP38  TESTPOINT_1MM_SQUARE  [TESTPOINT_SQUARE_1MM]  (value not drawn)  (no BOM)
TP62  TESTPOINT_1MM_SQUARE  [TESTPOINT_SQUARE_1MM]  (value not drawn)  (no BOM)

### Ports
CELL_V[0..16] (in), VC[0..16] (out)

### Nets
VBAT-: C1.1 C2.1
CELL_V0: D1.1(Anode) Q1.2(SOURCE) R1.1 TP21.1(=value)
CELL_V1: D2.1(Anode) Q2.2(SOURCE) R2.1 R34.2 TP20.1(=value)
CELL_V2: D3.1(Anode) Q3.2(SOURCE) R3.1 R35.2 TP19.1(=value)
CELL_V3: D4.1(Anode) Q4.2(SOURCE) R4.1 R36.2 TP18.1(=value)
CELL_V4: D5.1(Anode) Q5.2(SOURCE) R5.1 R37.2 TP17.1(=value)
CELL_V5: D6.1(Anode) Q6.2(SOURCE) R6.1 R38.2 TP15.1(=value)
CELL_V6: D7.1(Anode) Q7.2(SOURCE) R7.1 R39.2 TP14.1(=value)
CELL_V7: D8.1(Anode) Q8.2(SOURCE) R8.1 R40.2 TP13.1(=value)
CELL_V8: D9.1(Anode) Q9.2(SOURCE) R9.1 R41.2 TP12.1(=value)
CELL_V9: D10.1(Anode) Q10.2(SOURCE) R10.1 R42.2 TP11.1(=value)
CELL_V10: D11.1(Anode) Q11.2(SOURCE) R11.1 R43.2 TP10.1(=value)
CELL_V11: D12.1(Anode) Q12.2(SOURCE) R12.1 R44.2 TP9.1(=value)
CELL_V12: D16.1(Anode) Q18.2(SOURCE) R13.1 R45.2 TP8.1(=value)
CELL_V13: D15.1(Anode) Q16.2(SOURCE) R60.1 R89.2 TP25.1(=value)
CELL_V14: D14.1(Anode) Q15.2(SOURCE) R33.1 R48.2 TP16.1(=value)
CELL_V15: D13.1(Anode) Q14.2(SOURCE) R30.1 R31.2 TP6.1(=value)
CELL_V16: R15.1 R16.2 TP4.1(=value)
VC0: C1.2 R1.2 R18.2 TP38.1(=value)
VC1: C2.2 C3.1 R2.2 R19.2 TP37.1(=value)
VC2: C3.2 C4.1 R3.2 R20.2 TP36.1(=value)
VC3: C4.2 C5.1 R4.2 R21.2 TP35.1(=value)
VC4: C5.2 C6.1 R5.2 R22.2 TP34.1(=value)
VC5: C6.2 C7.1 R6.2 R23.2 TP33.1(=value)
VC6: C7.2 C8.1 R7.2 R24.2 TP32.1(=value)
VC7: C8.2 C9.1 R8.2 R25.2 TP31.1(=value)
VC8: C9.2 C10.1 R9.2 R26.2 TP30.1(=value)
VC9: C10.2 C11.1 R10.2 R27.2 TP29.1(=value)
VC10: C11.2 C12.1 R11.2 R28.2 TP28.1(=value)
VC11: C12.2 C13.1 R12.2 R29.2 TP27.1(=value)
VC12: C13.2 C17.1 R13.2 R103.2 TP26.1(=value)
VC13: C16.1 C17.2 R49.2 R60.2 TP62.1(=value)
VC14: C15.1 C16.2 R32.2 R33.2 TP24.1(=value)
VC15: C14.1 C15.2 R17.2 R30.2 TP7.1(=value)
VC16: C14.2 R15.2 TP5.1(=value)
NetD1_2: D1.2(Cathode) Q1.1(GATE) R18.1
NetD2_2: D2.2(Cathode) Q2.1(GATE) R19.1
NetD3_2: D3.2(Cathode) Q3.1(GATE) R20.1
NetD4_2: D4.2(Cathode) Q4.1(GATE) R21.1
NetD5_2: D5.2(Cathode) Q5.1(GATE) R22.1
NetD6_2: D6.2(Cathode) Q6.1(GATE) R23.1
NetD7_2: D7.2(Cathode) Q7.1(GATE) R24.1
NetD8_2: D8.2(Cathode) Q8.1(GATE) R25.1
NetD9_2: D9.2(Cathode) Q9.1(GATE) R26.1
NetD10_2: D10.2(Cathode) Q10.1(GATE) R27.1
NetD11_2: D11.2(Cathode) Q11.1(GATE) R28.1
NetD12_2: D12.2(Cathode) Q12.1(GATE) R29.1
NetD13_2: D13.2(Cathode) Q14.1(GATE) R17.1
NetD14_2: D14.2(Cathode) Q15.1(GATE) R32.1
NetD15_2: D15.2(Cathode) Q16.1(GATE) R49.1
NetD16_2: D16.2(Cathode) Q18.1(GATE) R103.1
NetQ1_3: Q1.3(DRAIN) R34.1
NetQ2_3: Q2.3(DRAIN) R35.1
NetQ3_3: Q3.3(DRAIN) R36.1
NetQ4_3: Q4.3(DRAIN) R37.1
NetQ5_3: Q5.3(DRAIN) R38.1
NetQ6_3: Q6.3(DRAIN) R39.1
NetQ7_3: Q7.3(DRAIN) R40.1
NetQ8_3: Q8.3(DRAIN) R41.1
NetQ9_3: Q9.3(DRAIN) R42.1
NetQ10_3: Q10.3(DRAIN) R43.1
NetQ11_3: Q11.3(DRAIN) R44.1
NetQ12_3: Q12.3(DRAIN) R45.1
NetQ14_3: Q14.3(DRAIN) R16.1
NetQ15_3: Q15.3(DRAIN) R31.1
NetQ16_3: Q16.3(DRAIN) R48.1
NetQ18_3: Q18.3(DRAIN) R89.1

### Notes on the sheet
- BALANCING FETS
- University of Waterloo
- 200 University Ave W
- REV
- (near TP33) PROJECT
- Waterloo, Ontario, Canada
- N2L 3G1
- (near TP33) DOCUMENT
- ENGINEER
- REVIEWER
- MODIFIED
- SHEET
- OF
- (in symbol RES_4.99Ω_2512_1%) 2512
- (in symbol RES_100Ω_0603_1%) 0603

### Library data of the parts
C1-C17 = CAP_0.1uF_16V_0603: CAP CER 0.1UF 16V X7R 0603; Manufacturer Part Number 1: CC0603KRX7R7BB104; Manufacturer 1: Yageo; Package: 0603; Supplier Part Number 1: 311-1088-1-ND; Supplier 1: Digi-Key; Dielectric: X7R
D1-D16 = DIO_ZENER_3V3: DIODE ZENER 3.3V 200mW SOD323F; Manufacturer 1: ON Semiconductor / Fairchild; Forward Voltage: 1V; Supplier Part Number 1: MM3Z3V3BCT-ND; Supplier 1: Digi-Key; Package/Case: SOD323F; Working Voltage: 3.3V
Q1-Q12 Q14-Q16 Q18 = NMOS_20V_2.6A: MOSFET N-CH 20V 2.6A SOT23-3; Manufacturer 1: Vishay Siliconix; Package/Footprint: SOT-23-3; Supplier 1: Digi-Key; Supplier Part Number 1: SI2302CDS-T1-E3CT-ND
R1-R13 R15 R30 R33 R60 = RES_100Ω_0603_1%: as R58 on sheet BQ76952_AFE; Supplier Part Number 1: 311-100HRCT-ND; Supplier 1: Digi-Key
R16 R31 R34-R45 R48 R89 = RES_4.99Ω_2512_1%: RES 4.99 OHM 1% 2W 2512; Manufacturer 1: Stackpole Electronics Inc; Manufacturer Part Number 1: RHC2512FT4R99; Supplier 1: Digi-Key; Supplier Part Number 1: RHC2512FT4R99CT-ND
R17-R29 R32 R49 R103 = RES_1kΩ_0603_1%: RES 1K OHM 1% 1/8W 0603; Manufacturer 1: Stackpole Electronics Inc; Manufacturer Part Number 1: RNCP0603FTD1K00; Supplier Part Number 1: RNCP0603FTD1K00CT-ND; Supplier 1: Digi-Key; Mounting Type: SMD; Package: 0603
TP4-TP21 TP24-TP38 TP62 = TESTPOINT_1MM_SQUARE: TESTPOINT 1MM SQUARE

## Sheet Temperature_Sense.SchDoc: LTO 16S BMS
size A4; Engineer: Farris Matar; Organization: TESLA Motors, INC; Address1: 3500 Deer Creek Road; Address2: Palo Alto, CA; Address4: U.S.A.; SheetNumber: 6; SheetTotal: 8
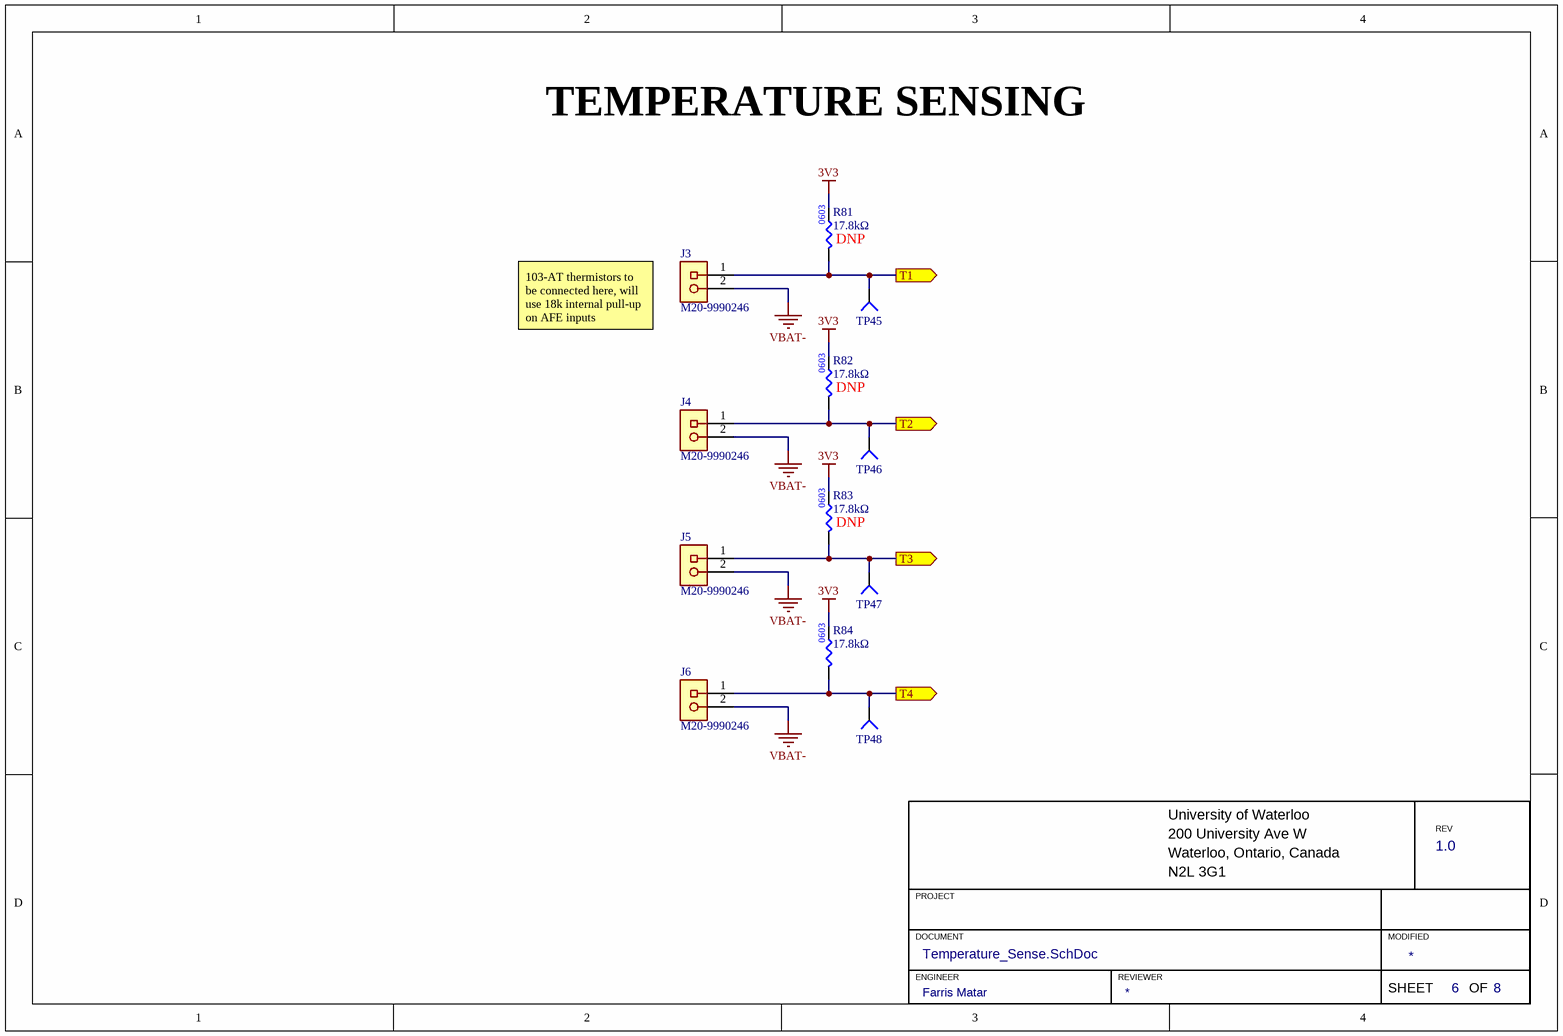
[diagram p4: Temperature_Sense.SchDoc]

### Parts
(Parts that share a designator on the sheet are numbered #1, #2 ... from top to bottom, then left to right.)
J3  Manufacturer Part Number 1: M20-9990246  [HDR1X2]  (hidden comment: HEADER 2x1)
J4#2  Manufacturer Part Number 1: M20-9990246  [HDR1X2]  (hidden comment: HEADER 2x1)
J5#2  Manufacturer Part Number 1: M20-9990246  [HDR1X2]  (hidden comment: HEADER 2x1)
J6#1  Manufacturer Part Number 1: M20-9990246  [HDR1X2]  (hidden comment: HEADER 2x1)
R81  value 17.8kΩ  [RES0603]  (hidden comment: RES_17.8kΩ_0603_1%)
R82  value 17.8kΩ  [RES0603]  (hidden comment: RES_17.8kΩ_0603_1%)
R83  value 17.8kΩ  [RES0603]  (hidden comment: RES_17.8kΩ_0603_1%)
R84  value 17.8kΩ  [RES0603]  (hidden comment: RES_17.8kΩ_0603_1%)
TP45  TESTPOINT_1MM_CIRCLE  [TESTPOINT_CIRCLE_1MM]  (value not drawn)  (no BOM)
TP46  TESTPOINT_1MM_CIRCLE  [TESTPOINT_CIRCLE_1MM]  (value not drawn)  (no BOM)
TP47  TESTPOINT_1MM_CIRCLE  [TESTPOINT_CIRCLE_1MM]  (value not drawn)  (no BOM)
TP48  TESTPOINT_1MM_CIRCLE  [TESTPOINT_CIRCLE_1MM]  (value not drawn)  (no BOM)

### Ports
T1 (out), T2 (out), T3 (out), T4 (out)

### Nets
3V3: R81.2 R82.2 R83.2 R84.2
VBAT-: J3.2 J4#2.2 J5#2.2 J6#1.2
T1: J3.1(VCC) R81.1 TP45.1(=value) ; port T1
T2: J4#2.1(VCC) R82.1 TP46.1(=value) ; port T2
T3: J5#2.1(VCC) R83.1 TP47.1(=value) ; port T3
NetJ6#1_1: J6#1.1(VCC) R84.1 TP48.1(=value) ; port T4

### Notes on the sheet
- TEMPERATURE SENSING
- (near R81) DNP
- 103-AT thermistors to be connected here, will use 18k internal pull-up on AFE inputs
- (near R82) DNP
- (near R83) DNP
- University of Waterloo
- 200 University Ave W
- REV
- PROJECT
- Waterloo, Ontario, Canada
- N2L 3G1
- DOCUMENT
- ENGINEER
- REVIEWER
- MODIFIED
- SHEET
- OF
- (in symbol RES_17.8kΩ_0603_1%) 0603

### Library data of the parts
J3 J4#2 J5#2 J6#1 = HEADER 2x1: Manufacturer 1: Harwin Inc.; Package/Footprint: TH; Mounting Type: TH; Supplier 1: Digi-Key; Supplier Part Number 1: 952-2262-ND
R81-R84 = RES_17.8kΩ_0603_1%: RES 17.8K OHM 1% 1/10W 0603; Manufacturer 1: YAGEO; Manufacturer Part Number 1: RC0603FR-0717K8L; Supplier Part Number 1: 311-17.8KHRCT-ND; Supplier 1: Digi-Key
TP45-TP48 = TESTPOINT_1MM_CIRCLE: TESTPOINT 1MM CIRCLE

## Sheet Pack_Interface.SchDoc: LTO 16S BMS
size A4; Engineer: Farris Matar; Organization: TESLA Motors, INC; Address1: 3500 Deer Creek Road; Address2: Palo Alto, CA; Address4: U.S.A.; SheetNumber: 8; SheetTotal: 7
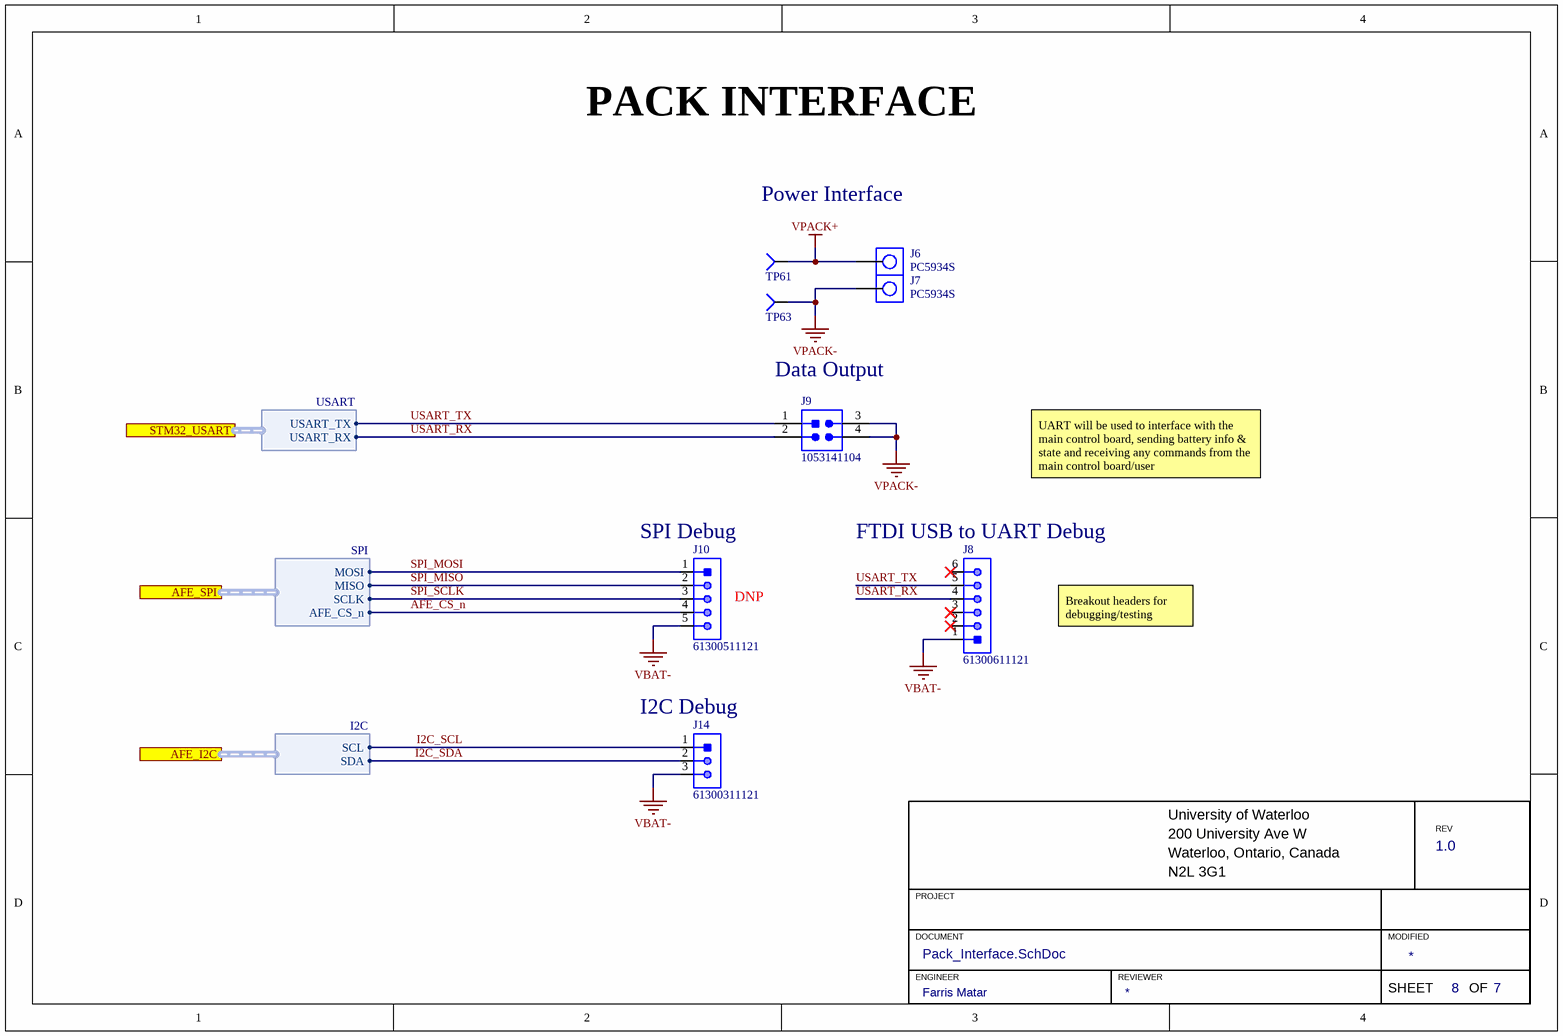
[diagram p5: Pack_Interface.SchDoc]

### Parts
(Parts that share a designator on the sheet are numbered #1, #2 ... from top to bottom, then left to right.)
J6#2  Manufacturer Part Number 1: PC5934S  [APP_PC5934S]  (hidden comment: CON_1POS_APP75)
J7  Manufacturer Part Number 1: PC5934S  [APP_PC5934S]  (hidden comment: CON_1POS_APP75)
J8  Manufacturer Part Number 1: 61300611121  [HDR1X6]  (hidden comment: HEADER 6x1)
J9  Manufacturer Part Number 1: 1053141104  [MOLEX-NANOFIT 2x2 THRA]  (hidden comment: 0430450412)
J10  Manufacturer Part Number 1: 61300511121  [HDR1X5]  (hidden comment: HEADER 5x1)
J14  Manufacturer Part Number 1: 61300311121  [HDR1X3]  (hidden comment: HEADER 3x1)
TP61  TESTPOINT_SMD_LOOP  [S1751-46R]  (value not drawn)
TP63  TESTPOINT_SMD_LOOP  [S1751-46R]  (value not drawn)

### Ports
AFE_I2C (harness I2C), AFE_SPI (harness SPI), STM32_USART (harness USART)

### Harnesses
USART: USART_TX, USART_RX
SPI: MOSI, MISO, SCLK, AFE_CS_n
I2C: SCL, SDA

### Nets
VBAT-: J8.1 J10.5 J14.3
VPACK+: J6#2.1 TP61.1(=value)
VPACK-: J7.1 J9.3 J9.4 TP63.1(=value)
AFE_CS_n: J10.4 ; port AFE_SPI.AFE_CS_n
I2C_SCL: J14.1 ; port AFE_I2C.SCL
I2C_SDA: J14.2 ; port AFE_I2C.SDA
SPI_MISO: J10.2 ; port AFE_SPI.MISO
SPI_MOSI: J10.1 ; port AFE_SPI.MOSI
SPI_SCLK: J10.3 ; port AFE_SPI.SCLK
USART_RX: J8.4 J9.2 ; port STM32_USART.USART_RX
USART_TX: J8.5 J9.1 ; port STM32_USART.USART_TX

Not connected (* = marked no-connect by the designer): J8 2* 3* 6*

### Notes on the sheet
- PACK INTERFACE
- Power Interface
- Data Output
- UART will be used to interface with the main control board, sending battery info & state and receiving any commands from the main control board/user
- (near J10) SPI Debug
- (near J8) FTDI USB to UART Debug
- (near J10) DNP
- Breakout headers for debugging/testing
- (near J14) I2C Debug
- University of Waterloo
- 200 University Ave W
- REV
- PROJECT
- Waterloo, Ontario, Canada
- N2L 3G1
- DOCUMENT
- ENGINEER
- REVIEWER
- MODIFIED
- SHEET
- OF

### Library data of the parts
J6#2 J7 = CON_1POS_APP75: as J4#1 on sheet Battery_Interface; Supplier 1: Digi-Key; Supplier Part Number 1: 2243-PC5934S-ND
J8 = HEADER 6x1: CONN HEADER VERT 6POS 2.54MM; Manufacturer 1: Würth Elektronik; Supplier 1: Digi-Key; Mounting Type: TH; Pitch: 2.54mm; Supplier Part Number 1: 732-5319-ND
J9 = CON_MOLEX-NANOFIT_2x2_THRA: CONN HEADER R/A 4POS 2.5MM; Manufacturer 1: Molex; Voltage Rating: 250V; Current Rating: 7.5A; Pitch: 2.5mm; Supplier 1: Digi-Key; Supplier Part Number 1: WM16907-ND
J10 = HEADER 5x1: CONN HEADER VERT 5POS 2.54MM; Manufacturer 1: Würth Elektronik; Supplier 1: Digi-Key; Mounting Type: TH; Pitch: 2.54mm; Supplier Part Number 1: 732-5318-ND
J14 = HEADER 3x1: CONN HEADER VERT 3POS 2.54MM; Manufacturer 1: Würth Elektronik; Supplier 1: Digi-Key; Mounting Type: TH; Pitch: 2.54mm; Supplier Part Number 1: 732-5316-ND
TP61 TP63 = TESTPOINT_SMD_LOOP: as TP1 on sheet Battery_Interface; Supplier 1: Digi-Key; Manufacturer Part Number 1: S1751-46R; Mounting Type: SMD; Package/Footprint: SMD; Supplier Part Number 1: 952-1478-1-ND

## Sheet High_Side_FETs.SchDoc: LTO 16S BMS
size A4; Engineer: Farris Matar; Organization: TESLA Motors, INC; Address1: 3500 Deer Creek Road; Address2: Palo Alto, CA; Address4: U.S.A.; SheetNumber: 5; SheetTotal: 8
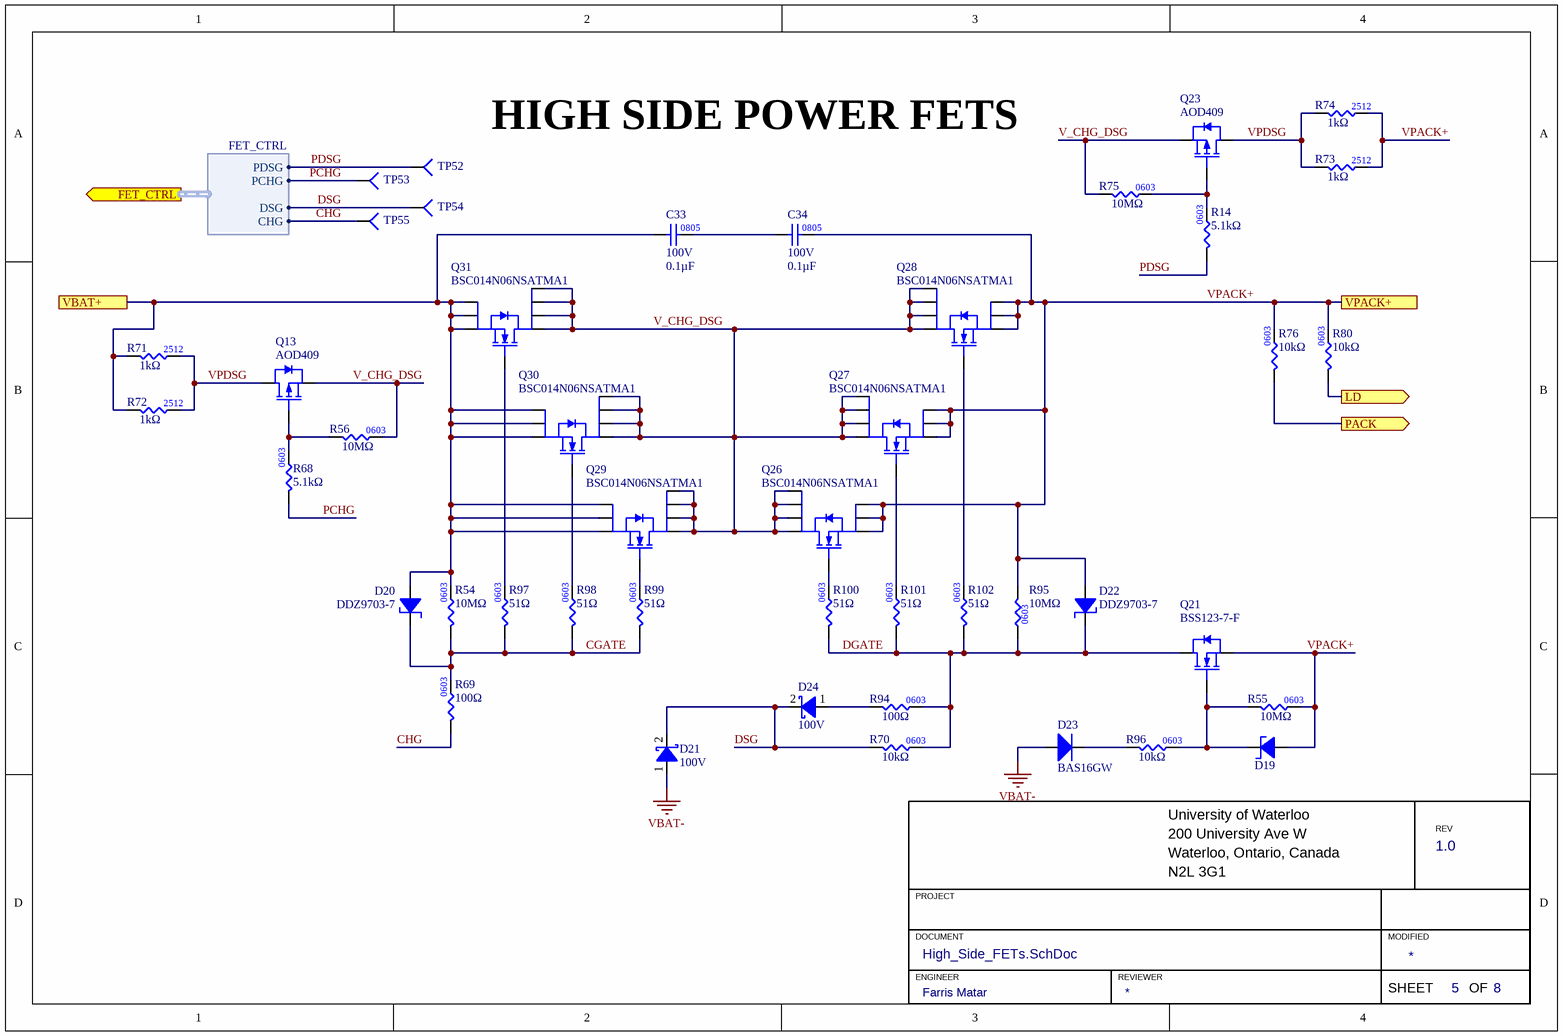
[diagram p6: High_Side_FETs.SchDoc]

### Parts
C33  value 0.1µF  Voltage Rating: 100V  [CAP0805]  (hidden comment: CAP_0.1uF_100V_0805)
C34  value 0.1µF  Voltage Rating: 100V  [CAP0805]  (hidden comment: CAP_0.1uF_100V_0805)
D19  DIO_ZENER_16V  [SOD-123_FLAT]  (value not drawn)
D20  Manufacturer Part Number 1: DDZ9703-7  [SOD-123_FLAT]  (hidden comment: DIO_ZENER_16V)
D21  Vr (Max): 100V  [SOD-123_FLAT]  (hidden comment: DIO_SCHOTTKY_100V_1A)
D22  Manufacturer Part Number 1: DDZ9703-7  [SOD-123_FLAT]  (hidden comment: DIO_ZENER_16V)
D23  Manufacturer Part Number 1: BAS16GW  [DIODSOD-123]  (hidden comment: DIO_100V_215mA)
D24  Vr (Max): 100V  [SOD-123_FLAT]  (hidden comment: DIO_SCHOTTKY_100V_1A)
Q13  Manufacturer Part Number 1: AOD409  [TO-252 AOSMD]  (hidden comment: PMOS_60V_26A)
Q21  Manufacturer Part Number 1: BSS123-7-F  [SOT23-3]  (hidden comment: NMOS_100V_170mA)
Q23  Manufacturer Part Number 1: AOD409  [TO-252 AOSMD]  (hidden comment: PMOS_60V_26A)
Q26  Manufacturer Part Number 1: BSC014N06NSATMA1  [INFINEON_8-POWERTDFN]  (hidden comment: NMOS_60V_30A)
Q27  Manufacturer Part Number 1: BSC014N06NSATMA1  [INFINEON_8-POWERTDFN]  (hidden comment: NMOS_60V_30A)
Q28  Manufacturer Part Number 1: BSC014N06NSATMA1  [INFINEON_8-POWERTDFN]  (hidden comment: NMOS_60V_30A)
Q29  Manufacturer Part Number 1: BSC014N06NSATMA1  [INFINEON_8-POWERTDFN]  (hidden comment: NMOS_60V_30A)
Q30  Manufacturer Part Number 1: BSC014N06NSATMA1  [INFINEON_8-POWERTDFN]  (hidden comment: NMOS_60V_30A)
Q31  Manufacturer Part Number 1: BSC014N06NSATMA1  [INFINEON_8-POWERTDFN]  (hidden comment: NMOS_60V_30A)
R14  value 5.1kΩ  [RES0603]  (hidden comment: RES_5.1kΩ_0603_1%)
R54  value 10MΩ  [RES0603]  (hidden comment: RES_10MΩ_0603_1%)
R55  value 10MΩ  [RES0603]  (hidden comment: RES_10MΩ_0603_1%)
R56  value 10MΩ  [RES0603]  (hidden comment: RES_10MΩ_0603_1%)
R68  value 5.1kΩ  [RES0603]  (hidden comment: RES_5.1kΩ_0603_1%)
R69  value 100Ω  [RES0603]  (hidden comment: RES_100Ω_0603_1%)
R70  value 10kΩ  [RES0603]  (hidden comment: RES_10kΩ_0603_1%)
R71  value 1kΩ  [RES2512]  (hidden comment: RES_1kΩ_2512_1%)
R72  value 1kΩ  [RES2512]  (hidden comment: RES_1kΩ_2512_1%)
R73  value 1kΩ  [RES2512]  (hidden comment: RES_1kΩ_2512_1%)
R74  value 1kΩ  [RES2512]  (hidden comment: RES_1kΩ_2512_1%)
R75  value 10MΩ  [RES0603]  (hidden comment: RES_10MΩ_0603_1%)
R76  value 10kΩ  [RES0603]  (hidden comment: RES_10kΩ_0603_1%)
R80  value 10kΩ  [RES0603]  (hidden comment: RES_10kΩ_0603_1%)
R94  value 100Ω  [RES0603]  (hidden comment: RES_100Ω_0603_1%)
R95  value 10MΩ  [RES0603]  (hidden comment: RES_10MΩ_0603_1%)
R96  value 10kΩ  [RES0603]  (hidden comment: RES_10kΩ_0603_1%)
R97  value 51Ω  [RES0603]  (hidden comment: RES_51Ω_0603_1%)
R98  value 51Ω  [RES0603]  (hidden comment: RES_51Ω_0603_1%)
R99  value 51Ω  [RES0603]  (hidden comment: RES_51Ω_0603_1%)
R100  value 51Ω  [RES0603]  (hidden comment: RES_51Ω_0603_1%)
R101  value 51Ω  [RES0603]  (hidden comment: RES_51Ω_0603_1%)
R102  value 51Ω  [RES0603]  (hidden comment: RES_51Ω_0603_1%)
TP52  TESTPOINT_1MM_CIRCLE  [TESTPOINT_CIRCLE_1MM]  (value not drawn)  (no BOM)
TP53  TESTPOINT_1MM_CIRCLE  [TESTPOINT_CIRCLE_1MM]  (value not drawn)  (no BOM)
TP54  TESTPOINT_1MM_CIRCLE  [TESTPOINT_CIRCLE_1MM]  (value not drawn)  (no BOM)
TP55  TESTPOINT_1MM_CIRCLE  [TESTPOINT_CIRCLE_1MM]  (value not drawn)  (no BOM)

### Ports
FET_CTRL (out, harness FET_CTRL), LD (out), PACK (out), VBAT+, VPACK+

### Harnesses
FET_CTRL: PDSG, PCHG, DSG, CHG

### Nets
VBAT+: C33.1 D20.1(Anode) Q29.1(Source) Q29.2(Source) Q29.3(Source) Q30.1(Source) Q30.2(Source) Q30.3(Source) Q31.1(Source) Q31.2(Source) Q31.3(Source) R54.2 R71.1 R72.1 ; port VBAT+
VBAT-: D21.1(Anode) D23.1(A)
VPACK+: C34.2 D19.1(Anode) D22.1(Anode) Q21.2(SOURCE) Q26.1(Source) Q26.2(Source) Q26.3(Source) Q27.1(Source) Q27.2(Source) Q27.3(Source) Q28.1(Source) Q28.2(Source) Q28.3(Source) R55.2 R73.2 R74.2 R76.2 R80.2 R95.2 ; port VPACK+
CGATE: D20.2(Cathode) R54.1 R69.2 R97.1 R98.1 R99.1
CHG: R69.1 TP55.1(=value) ; port FET_CTRL.CHG
DGATE: D22.2(Cathode) Q21.3(DRAIN) R70.2 R94.2 R95.1 R100.1 R101.1 R102.1
DSG: D21.2(Cathode) D24.2(Cathode) R70.1 TP54.1(=value) ; port FET_CTRL.DSG
LD: R80.1 ; port LD
PACK: R76.1 ; port PACK
PCHG: R68.1 TP53.1(=value) ; port FET_CTRL.PCHG
PDSG: R14.1 TP52.1(=value) ; port FET_CTRL.PDSG
V_CHG_DSG: Q13.3(Source) Q23.3(Source) Q26.5(Drain) Q26.6(Drain) Q26.7(Drain) Q26.8(Drain) Q27.5(Drain) Q27.6(Drain) Q27.7(Drain) Q27.8(Drain) Q28.5(Drain) Q28.6(Drain) Q28.7(Drain) Q28.8(Drain) Q29.5(Drain) Q29.6(Drain) Q29.7(Drain) Q29.8(Drain) Q30.5(Drain) Q30.6(Drain) Q30.7(Drain) Q30.8(Drain) Q31.5(Drain) Q31.6(Drain) Q31.7(Drain) Q31.8(Drain) R56.2 R75.1
VPDSG: Q13.2(Drain) Q23.2(Drain) R71.2 R72.2 R73.1 R74.1
NetC33_2: C33.2 C34.1
NetD19_2: D19.2(Cathode) Q21.1(GATE) R55.1 R96.2
NetD23_2: D23.2(K) R96.1
NetD24_1: D24.1(Anode) R94.1
NetQ13_1: Q13.1(Gate) R56.1 R68.2
NetQ23_1: Q23.1(Gate) R14.2 R75.2
NetQ26_4: Q26.4(Gate) R100.2
NetQ27_4: Q27.4(Gate) R101.2
NetQ28_4: Q28.4(Gate) R102.2
NetQ29_4: Q29.4(Gate) R99.2
NetQ30_4: Q30.4(Gate) R98.2
NetQ31_4: Q31.4(Gate) R97.2

### Notes on the sheet
- HIGH SIDE POWER FETS
- University of Waterloo
- 200 University Ave W
- REV
- PROJECT
- Waterloo, Ontario, Canada
- N2L 3G1
- DOCUMENT
- ENGINEER
- REVIEWER
- MODIFIED
- SHEET
- OF
- (in symbol RES_10MΩ_0603_1%) 0603
- (in symbol RES_51Ω_0603_1%) 0603
- (in symbol RES_100Ω_0603_1%) 0603

### Library data of the parts
C33 C34 = CAP_0.1uF_100V_0805: as C32 on sheet BQ76952_AFE; Package: 0805; Supplier 1: Digi-Key; Supplier Part Number 1: 445-1418-1-ND
D19 = DIO_ZENER_16V: DIODE ZENER 16V 500MW SOD123; Manufacturer Part Number 1: DDZ9703-7; Manufacturer 1: Diodes Incorporated; Forward Voltage: 900mV; Supplier 1: Digi-Key; Supplier Part Number 1: DDZ9703-7DICT-ND
D20 D22 = DIO_ZENER_16V: DIODE ZENER 16V 500MW SOD123; Manufacturer 1: Diodes Incorporated; Forward Voltage: 900mV; Supplier 1: Digi-Key; Supplier Part Number 1: DDZ9703-7DICT-ND
D21 D24 = DIO_SCHOTTKY_100V_1A: as D17 on sheet BQ76952_AFE; Supplier 1: Digi-Key; Supplier Part Number 1: 1655-DSS110UCT-ND; Mounting Type: SMD; Package/Footprint: SOD-123F
D23 = DIO_100V_215mA: DIODE GEN PURP 100V 215MA SOD123; Manufacturer 1: Nexperia; Package/Footprint: SOD-123; Package: SOD-123; Supplier Part Number 1: 1727-7320-1-ND; Supplier 1: Digi-Key; Mounting Type: SMD; Verified: No
Q13 Q23 = PMOS_60V_26A: MOSFET P-CH 60V 26A TO252; Manufacturer 1: Alpha & Omega Semiconductor Inc.; Vgs (Max): ±20V; Vdss: 60V; Mounting Type: SMD; Id: 26A; Supplier 1: Digi-Key; Supplier Part Number 1: 785-1103-1-ND
Q21 = NMOS_100V_170mA: MOSFET N-CH 100V 170MA SOT23-3; Manufacturer 1: Diodes Incorporated; Supplier 1: Digi-Key; Supplier Part Number 1: BSS123-FDICT-ND
Q26-Q31 = NMOS_60V_30A: MOSFET N-CH 60V 30A/100A TDSON7; Manufacturer 1: Infineon Technologies; FET Type: N-Channel; Vgs (Max): 20V; Power Dissipation (Max): 2.5W; Id: 30A; Supplier 1: Digi-Key; Supplier Part Number 1: BSC014N06NSATMA1CT-ND; Vdss: 60V; Supplier Device Package: 8-PowerTDFN
R14 R68 = RES_5.1kΩ_0603_1%: RES 5.1K OHM 1% 1/10W 0603; Manufacturer 1: YAGEO; Manufacturer Part Number 1: RC0603FR-135K1L; Mounting Type: SMD; Package: 0603; Supplier 1: Digi-Key; Supplier Part Number 1: 13-RC0603FR-135K1LCT-ND
R54-R56 R75 R95 = RES_10MΩ_0603_1%: RES 10M OHM 1% 1/10W 0603; Manufacturer 1: YAGEO; Manufacturer Part Number 1: RC0603FR-0710ML; Supplier 1: Digi-Key; Supplier Part Number 1: 311-10.0MHRCT-ND
R69 R94 = RES_100Ω_0603_1%: as R58 on sheet BQ76952_AFE; Supplier Part Number 1: 311-100HRCT-ND; Supplier 1: Digi-Key
R70 R76 R80 R96 = RES_10kΩ_0603_1%: as R59 on sheet BQ76952_AFE; Supplier Part Number 1: RNCP0603FTD10K0CT-ND; Supplier 1: Digi-Key; Mounting Type: SMD; Package: 0603
R71-R74 = RES_1kΩ_2512_1%: RES SMD 1K OHM 1% 3W 2512; Manufacturer 1: TE Connectivity Passive Product; Manufacturer Part Number 1: 35221K0FT; Supplier Part Number 1: A121161CT-ND; Supplier 1: Digi-Key; Mounting Type: SMD; Package: 2512
R97-R102 = RES_51Ω_0603_1%: RES 51 OHM 1% 1/10W 0603; Manufacturer 1: YAGEO; Manufacturer Part Number 1: RC0603FR-0751RL; Supplier 1: Digi-Key; Supplier Part Number 1: 311-51.0HRCT-ND
TP52-TP55 = TESTPOINT_1MM_CIRCLE: TESTPOINT 1MM CIRCLE

## Nets that join several sheets
3V3: BQ76952_AFE (C19.2 TP3.1 U1.35), Temperature_Sense (R81.2 R82.2 R83.2 R84.2)
VBAT+: Battery_Interface (F1.2 TP2.1), BQ76952_AFE (C20.2 C21.2 D17.1 D18.1), High_Side_FETs (14 pins)
VBAT-: Battery_Interface (6 pins), BQ76952_AFE (10 pins), Balancing_FETs (C1.1 C2.1), Temperature_Sense (J3.2 J4#2.2 J5#2.2 J6#1.2), Pack_Interface (J8.1 J10.5 J14.3), High_Side_FETs (D21.1 D23.1)
VPACK+: Pack_Interface (J6#2.1 TP61.1), High_Side_FETs (19 pins)
VPACK-: BQ76952_AFE (C32.2 R62.1 R63.2), Pack_Interface (J7.1 J9.3 J9.4 TP63.1)
AFE_CS_n: BQ76952_AFE (U1.29), Pack_Interface (J10.4)
CHG: BQ76952_AFE (U1.45), High_Side_FETs (R69.1 TP55.1)
DSG: BQ76952_AFE (U1.43), High_Side_FETs (D21.2 D24.2 R70.1 TP54.1)
I2C_SCL: BQ76952_AFE (R90.2), Pack_Interface (J14.1)
I2C_SDA: BQ76952_AFE (R91.2), Pack_Interface (J14.2)
LD: BQ76952_AFE (TP44.1 U1.41), High_Side_FETs (R80.1)
NetJ6#1_1: BQ76952_AFE (U1.31), Temperature_Sense (J6#1.1 R84.1 TP48.1)
PACK: BQ76952_AFE (TP60.1 U1.42), High_Side_FETs (R76.1)
PCHG: BQ76952_AFE (U1.40), High_Side_FETs (R68.1 TP53.1)
PDSG: BQ76952_AFE (U1.39), High_Side_FETs (R14.1 TP52.1)
SPI_MISO: BQ76952_AFE (R57.2), Pack_Interface (J10.2)
SPI_MOSI: BQ76952_AFE (R87.2), Pack_Interface (J10.1)
SPI_SCLK: BQ76952_AFE (R88.2), Pack_Interface (J10.3)
T1: BQ76952_AFE (U1.21), Temperature_Sense (J3.1 R81.1 TP45.1)
T2: BQ76952_AFE (U1.22), Temperature_Sense (J4#2.1 R82.1 TP46.1)
T3: BQ76952_AFE (U1.23), Temperature_Sense (J5#2.1 R83.1 TP47.1)

## Assembly variants
BUILD: not fitted C28 J10 R46 R47 R51 R57 R66 R81 R82 R83 R87 R88 U3